# Altium project Mixed_Signal.PrjPcb
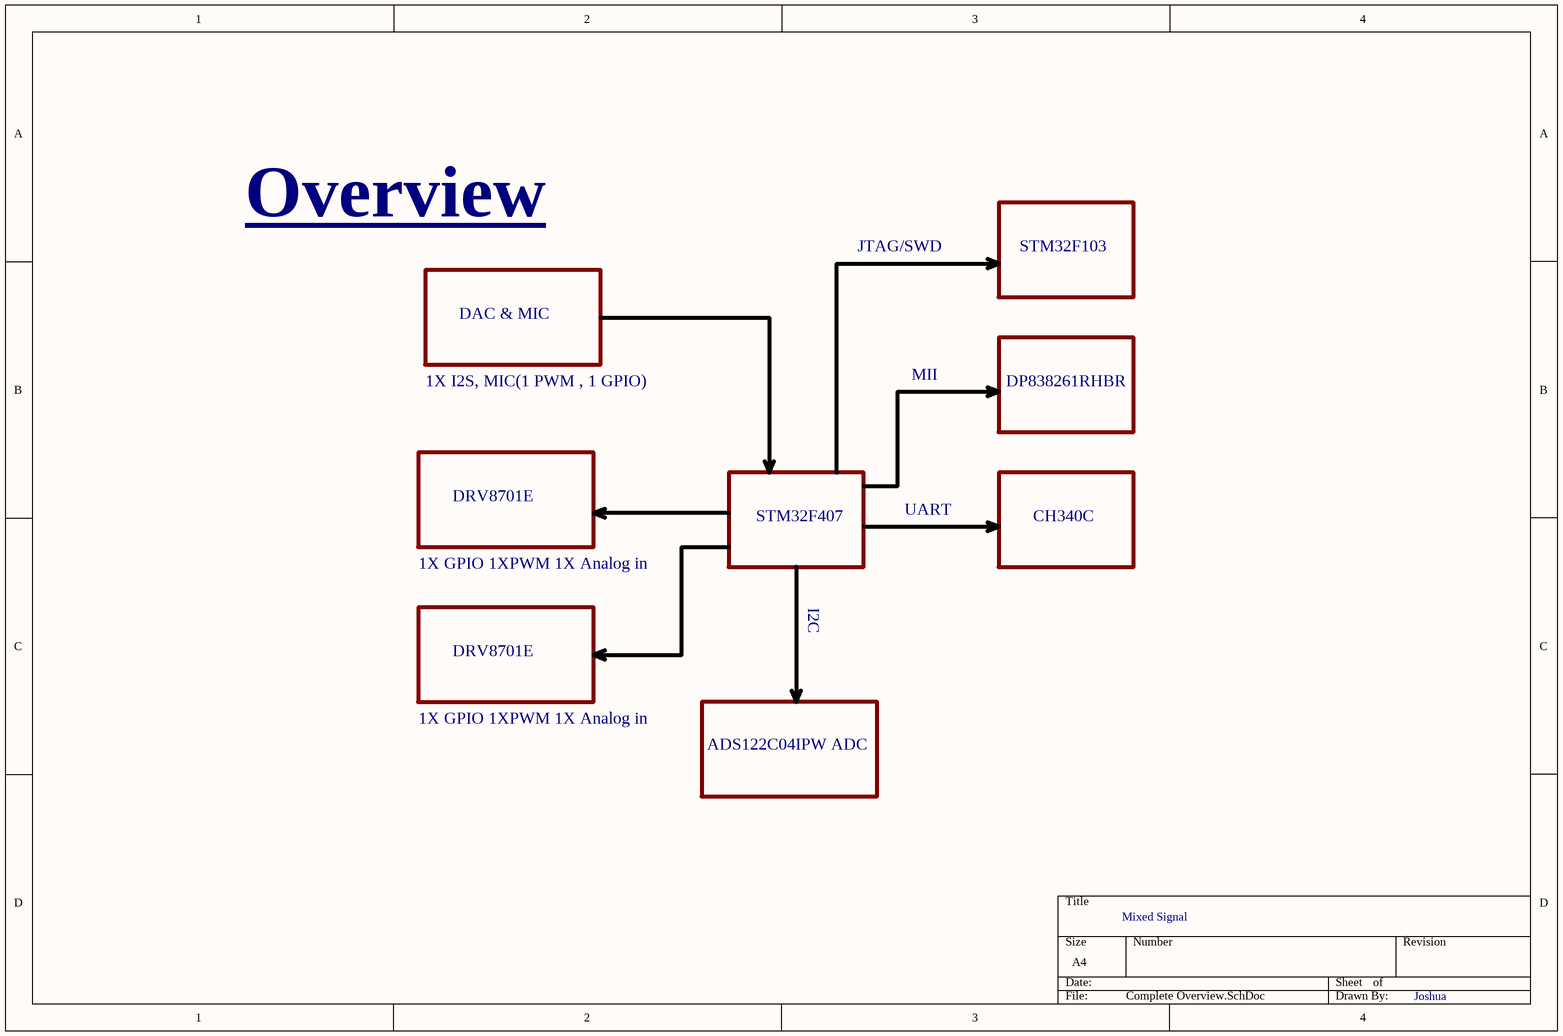
[diagram p0: Complete Overview.SchDoc]
12 sheets, 188 parts. Net scope: flat (ports and power ports of the same name join across sheets).
Board file: Mixed_Board.PcbDoc
Sheets:
  Complete Overview.SchDoc
  Ethernet Overview.SchDoc
  Power Block.SchDoc
  STM32Debuuger.SchDoc
  EthernetPHY.SchDoc
  MotorDriver.SchDoc
  MotorDriver2.SchDoc
  ADC.SchDoc
  DAC.SchDoc
  STM32F407.SchDoc
  Power.SchDoc
  USB-TTL.SchDoc

## Sheet Complete Overview.SchDoc
size A4; DocumentNumber: 1; SheetNumber: 1; SheetTotal: 12

### Notes on the sheet
- Overview
- JTAG/SWD
- STM32F103
- DAC & MIC
- MII
- 1X I2S, MIC(1 PWM , 1 GPIO)
- DP838261RHBR
- DRV8701E
- UART
- 1X GPIO 1XPWM 1X Analog in
- STM32F407
- CH340C
- I2C
- ADS122C04IPW ADC
- Mixed Signal
- Joshua

## Sheet Ethernet Overview.SchDoc
size A4; DocumentNumber: 2; SheetNumber: 2; SheetTotal: 12
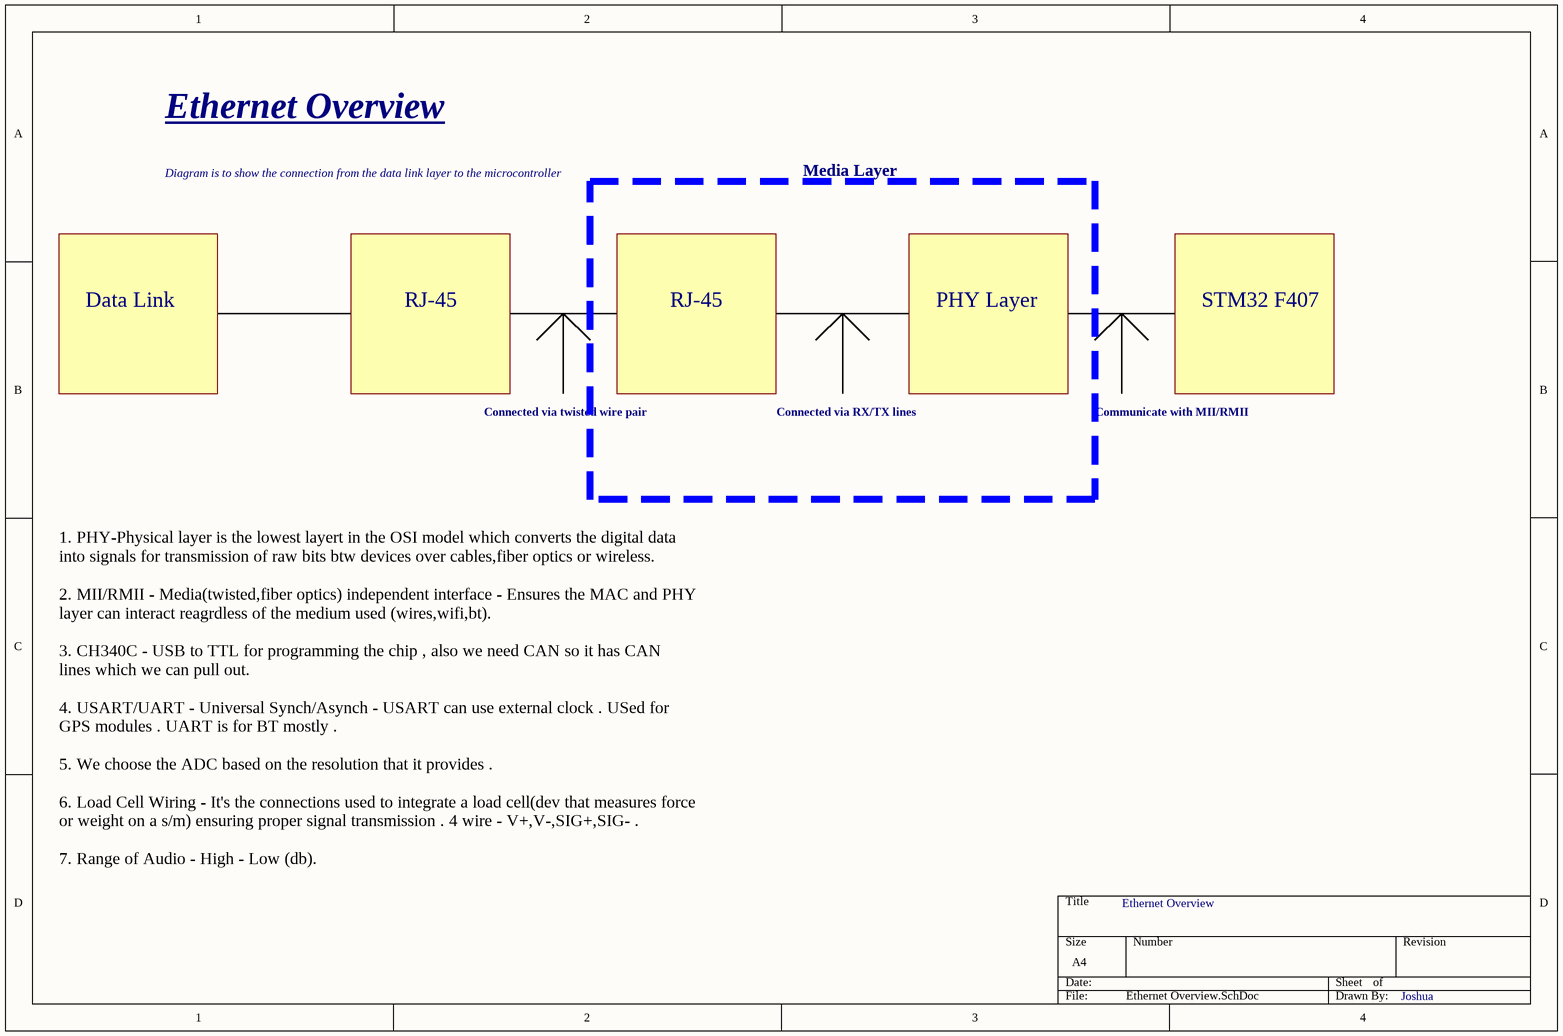
[diagram p1: Ethernet Overview.SchDoc]

### Notes on the sheet
- Ethernet Overview
- Diagram is to show the connection from the data link layer to the microcontroller
- Media Layer
- Data Link
- RJ-45
- PHY Layer
- STM32 F407
- Connected via twisted wire pair
- Connected via RX/TX lines
- Communicate with MII/RMII
- 1. PHY-Physical layer is the lowest layert in the OSI model which converts the digital data into signals for transmission of raw bits btw devices over cables,fiber optics or wireless.
  2. MII/RMII - Media(twisted,fiber optics) independent interface - Ensures the MAC and PHY layer can interact reagrdless of the medium used (wires,wifi,bt).
  3. CH340C - USB to TTL for programming the chip , also we need CAN so it has CAN lines which we can pull out.
  4. USART/UART - Universal Synch/Asynch - USART can use external clock . USed for GPS modules . UART is for BT mostly .
  5. We choose the ADC based on the resolution that it provides .
  6. Load Cell Wiring - It's the connections used to integrate a load cell(dev that measures force or weight on a s/m) ensuring proper signal transmission . 4 wire - V+,V-,SIG+,SIG- .
  7. Range of Audio - High - Low (db).
- Joshua

## Sheet Power Block.SchDoc
size A4; DocumentNumber: 3; SheetNumber: 3; SheetTotal: 12
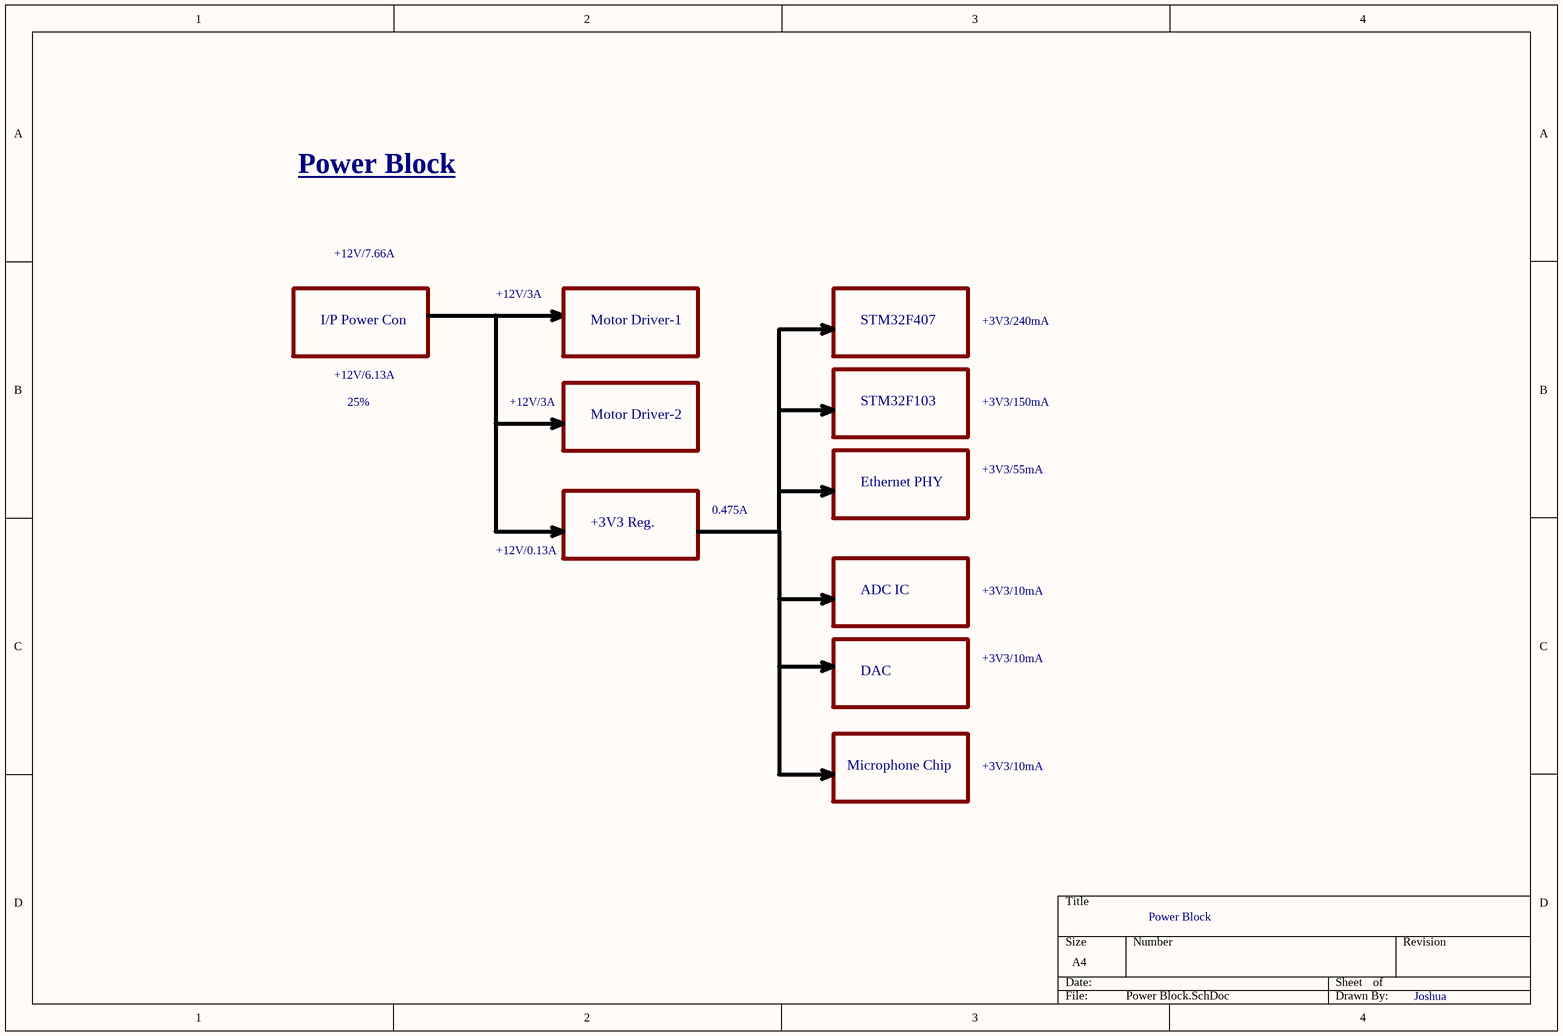
[diagram p2: Power Block.SchDoc]

### Notes on the sheet
- Power Block
- +12V/7.66A
- +12V/3A
- I/P Power Con
- +12V/6.13A
- Motor Driver-1
- STM32F407
- +3V3/240mA
- 25%
- Motor Driver-2
- STM32F103
- +3V3/150mA
- 0.475A
- Ethernet PHY
- +3V3/55mA
- +12V/0.13A
- +3V3 Reg.
- ADC IC
- +3V3/10mA
- DAC
- Microphone Chip
- Joshua

## Sheet STM32Debuuger.SchDoc
size A4; DocumentNumber: 4; SheetNumber: 4; SheetTotal: 12
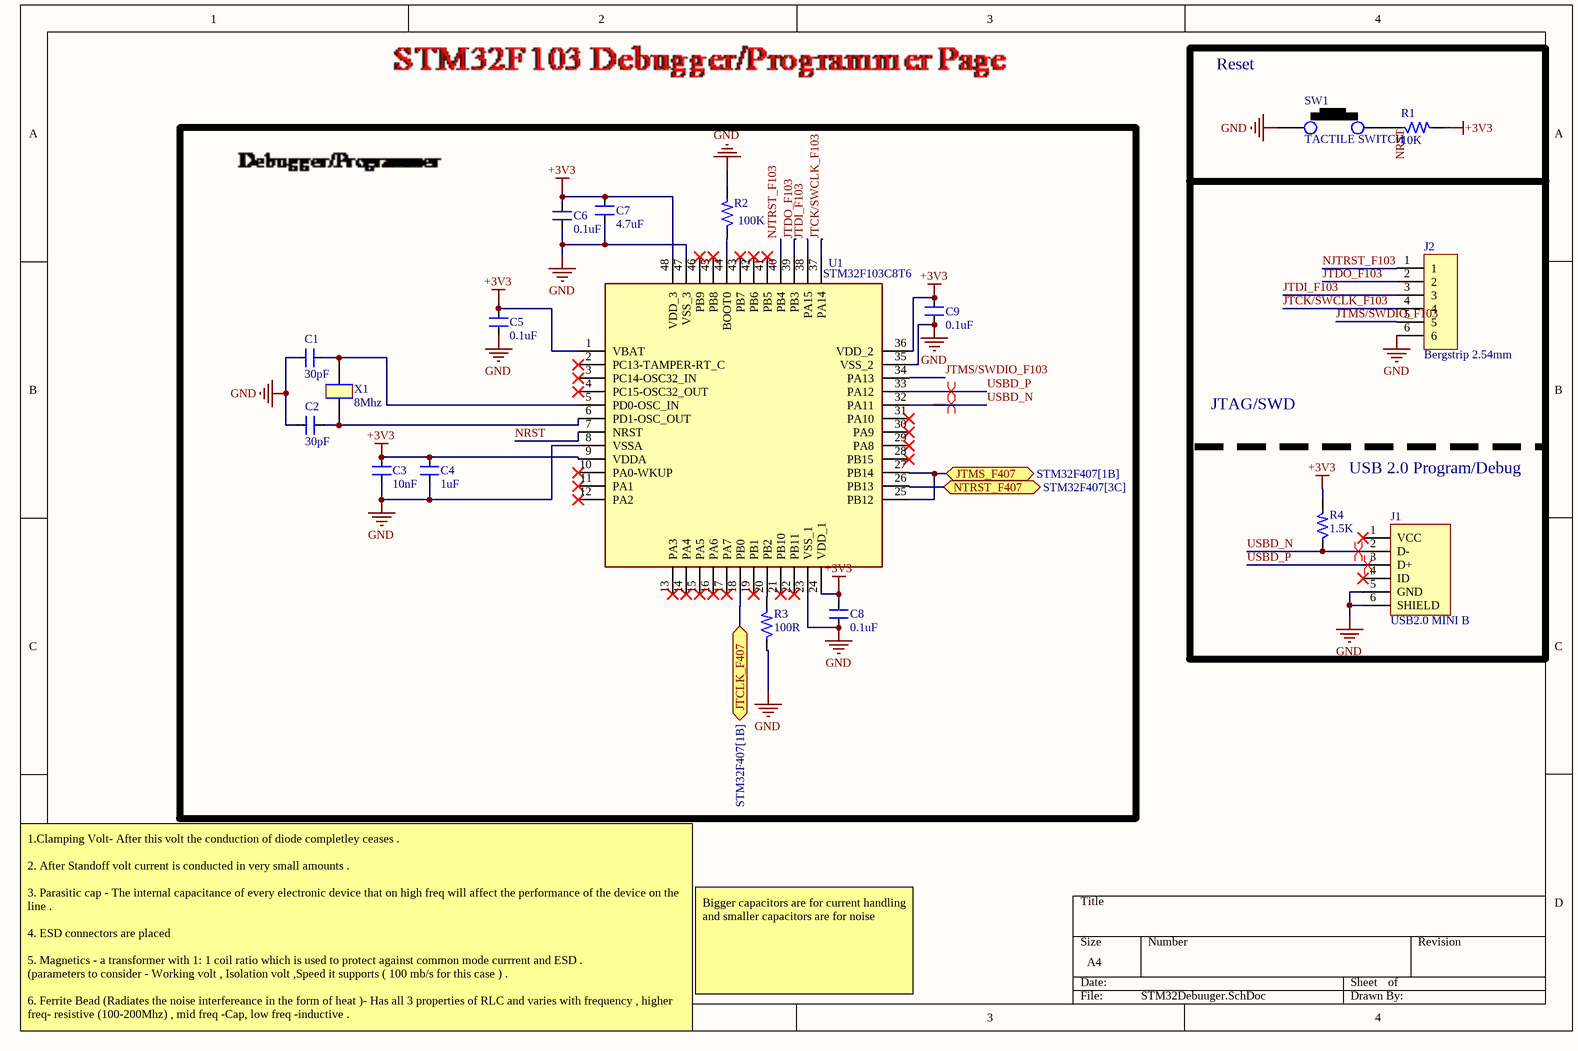
[diagram p3: STM32Debuuger.SchDoc]

### Parts
C1  30pF  [CAP_0805]
C2  30pF  [CAP_0805]
C3  10nF  [CAP_0805]
C4  1uF  [CAP_0805]
C5  0.1uF  [CAP_0805]
C6  0.1uF  [CAP_0805]
C7  4.7uF  [CAP_0805]
C8  0.1uF  [CAP_0805]
C9  0.1uF  [CAP_0805]
J1  USB2.0 MINI B  [CON_690-005-299-043]
J2  Bergstrip 2.54mm  [CON6_100_59D78_TH_ST]
R1  10K  [RES_0603]
R2  100K  [RES_0805]
R3  100R  [RES_0603]
R4  1.5K  [RES_0805]
SW1  TACTILE SWITCH  [SW_342_SMD]
U1  STM32F103C8T6  [LQFP-48_19.6_393_58X11_SMD]
X1  8Mhz  [XTAL_314_240X47_SMD]

### Ports
JTCLK_F407 (bidir, see STM32F407[1B]), JTMS_F407 (bidir, see STM32F407[1B]), NTRST_F407 (bidir, see STM32F407[3C])

### Nets
+3V3: C3.2 C4.2 C5.2 C6.2 C7.2 C8.2 C9.2 R1.2 R4.2 U1.1(VBAT) U1.9(VDDA) U1.24(VDD_1) U1.36(VDD_2) U1.48(VDD_3)
GND: C1.1 C2.1 C3.1 C4.1 C5.1 C6.1 C7.1 C8.1 C9.1 J1.5(GND) J1.6(SHIELD) J2.6 R2.2 R3.1 SW1.1 U1.8(VSSA) U1.23(VSS_1) U1.35(VSS_2) U1.47(VSS_3)
JTCK/SWCLK_F103: J2.4 U1.37(PA14)
JTDI_F103: J2.3 U1.38(PA15)
JTDO_F103: J2.2 U1.39(PB3)
JTMS/SWDIO_F103: J2.5 U1.34(PA13)
NJTRST_F103: J2.1 U1.40(PB4)
NRST: R1.1 SW1.2 U1.7(NRST)
NTRST_F407: U1.26(PB13) ; port NTRST_F407
USBD_N: J1.2(D-) R4.1 U1.32(PA11)
USBD_P: J1.3(D+) U1.33(PA12)
NetC1_2: C1.2 U1.5(PD0-OSC_IN) X1.2
NetC2_2: C2.2 U1.6(PD1-OSC_OUT) X1.1
NetR2_1: R2.1 U1.44(BOOT0)
NetR3_2: R3.2 U1.20(PB2)
NetU1_18: U1.18(PB0) ; port JTCLK_F407
NetU1_25: U1.25(PB12) U1.27(PB14) ; port JTMS_F407

Not connected (* = marked no-connect by the designer): J1 1(VCC)* 4(ID)*; U1 2(PC13-TAMPER-RT_C)* 3(PC14-OSC32_IN)* 4(PC15-OSC32_OUT)* 10(PA0-WKUP)* 11(PA1)* 12(PA2)* 13(PA3)* 14(PA4)* 15(PA5)* 16(PA6)* 17(PA7)* 19(PB1)* 21(PB10)* 22(PB11)* 28(PB15)* 29(PA8)* 30(PA9)* 31(PA10)* 41(PB5)* 42(PB6)* 43(PB7)* 45(PB8)* 46(PB9)*

### Layout directives
differential pair: (no net found under the mark), USBD_N, USBD_P

### Notes on the sheet
- Reset
- JTAG/SWD
- USB 2.0 Program/Debug
- Bigger capacitors are for current handling and smaller capacitors are for noise
- 1.Clamping Volt- After this volt the conduction of diode completley ceases .
  2. After Standoff volt current is conducted in very small amounts .
  3. Parasitic cap - The internal capacitance of every electronic device that on high freq will affect the performance of the device on the line .
  4. ESD connectors are placed
  5. Magnetics - a transformer with 1: 1 coil ratio which is used to protect against common mode currrent and ESD .
  (parameters to consider - Working volt , Isolation volt ,Speed it supports ( 100 mb/s for this case ) .
  6. Ferrite Bead (Radiates the noise interfereance in the form of heat )- Has all 3 properties of RLC and varies with frequency , higher freq- resistive (100-200Mhz) , mid freq -Cap, low freq -inductive .
  7.

### Library data of the parts
C1 C2 = CAP_30pF-50V-10%-0805: ±10% 50V Ceramic Capacitor C0G, NP0 0805 (2012 Metric); Manufacturer Part Number: C0805C300K5GAC7800; Manufacturer: KEMET; Alternate Part Number: NA; Case/Package: 0805; Supplier-1: Digikey; Supplier Part Number-1: 399-17443-1-ND - Cut Tape (CT)
C3 = CAP_10nF-50V-10%-0805: 10000pF ±10% 50V Ceramic Capacitor X7R 0805 (2012 Metric); Manufacturer: Samsung; Manufacturer Part Number: C0805C103K5RECAUTO; Alternate Part Number-1: GRM2195C1H103JA01D; Case/Package: 0805; Supplier-1: SIRICOM; Supplier Part Number-1: 0805B103K500CT
C4 = CAP_1uF-50V-5%-0805: 1µF ±5% 50V Ceramic Capacitor X7R 0805 (2012 Metric); Manufacturer: Samsung; Manufacturer Part Number: CC0805JKX7R9BB105; Alternate Part Number-1: 0805F105M500NT; Case/Package: 0805; Supplier-1: SIRICOM; Supplier Part Number-1: CL21B105KBFNNNE
C5 C6 C8 C9 = CAP_0.1uF-50V-10%-0805: 0.1µF ±10% 50V Ceramic Capacitor X7R 0805 (2012 Metric); Manufacturer: Samsung; Manufacturer Part Number: CL21B104KBCNNNC; Alternate Part Number-1: NA; Case/Package: 0805; Supplier-1: SIRICOM; Supplier Part Number-1: 0805B104K500CT
C7 = CAP_4.7uF-50V-10%-0805: 4.7µF ±10% 50V Ceramic Capacitor X5R 0805 (2012 Metric); Manufacturer: Yageo; Manufacturer Part Number: GRM21BR61H475KE51L; Alternate Part Number-1: NA; Case/Package: 0805; Supplier-1: SIRICOM; Supplier Part Number-1: CL21A475KBQNNNE
J1 = CON_USB2.0-MINIB-SMD: USB - mini B USB 2.0 Receptacle Connector 5 Position Surface Mount, Right Angle; Manufacturer: EDAC; Manufacturer Part Number: 690-005-299-043; Alternate Part Number-1: NA; Case/Package: USB-MINI-B; Supplier-1: LCSC; Supplier Part Number-1: C105424
J2 = CON-BS-SKT_6X1-100-ST-TH: 6 Pins, 1 Row 2.54mm Pitch, Straight bergstrip, Female; Manufacturer: Molex; Alternate Part Number-1: NA; Manufacturer Part Number: 22-10-2061; Case/Package: TH-CON; Supplier-1: SP ROAD; Supplier Part Number-1: NA
R1 = RES_10K-0.1W-1%-0603: 10 kOhms ±1% 0.1W, 1/10W Chip Resistor 0603 (1608 Metric) Automotive AEC-Q200 Thick Film; Manufacturer: Walsin; Manufacturer Part Number: WR06X1002FTL; Alternate Part Number-1: 0603WAJ0103T5E; Case/Package: 0603; Supplier-1: SIRICOM; Supplier Part Number-1: WR06X1002FTL
R2 = RES_100K-0.125W-1%-0805: 100 kOhms ±1% 0.125W, 1/8W Chip Resistor 0805 (2012 Metric) Automotive AEC-Q200 Thick Film; Manufacturer: Walsin; Manufacturer Part Number: WR08X1003FTL; Alternate Part Number-1: NA; Case/Package: 0805; Supplier-1: SIRICOM; Supplier Part Number-1: WR08X1003FTL
R3 = RES_100R-0.1W-1%-0603: 100 Ohms ±1% 0.1W, 1/10W Chip Resistor 0603 (1608 Metric) Thick Film; Manufacturer: Walsin; Manufacturer Part Number: WR06X1000FTL; Alternate Part Number-1: MR06X1000FTL; Case/Package: 0603; Supplier-1: SIRICOM; Supplier Part Number-1: WALSIN:WR06X1000FTL
R4 = RES_1.5K-0.125W-1%-0805: 1.5 kOhms ±1% 0.125W, 1/8W Chip Resistor 0805 (2012 Metric) Thick Film; Manufacturer: TE Connectivity Passive Product; Manufacturer Part Number: CRG0805F1K5; Alternate Part Number-1: NA; Case/Package: 0805; Supplier-1: SIRICOM; Supplier Part Number-1: NA
SW1 = SW1_RS-282G05A3-SMRT-SMD: Tactile Switch SPST-NO Top Actuated Surface Mount; Manufacturer: ITT C&K; Alternate Part Number-1: NA; Manufacturer Part Number: RS-282G05A3-SMRT; Case/Package: SMD; Supplier-1: SP ROAD; Supplier Part Number-1: RS-282G05A3-SMRT
U1 = IC_STM32F103C8T6: ARM® Cortex®-M3 STM32F1 Microcontroller IC 32-Bit 72MHz 64KB (64K x 8) FLASH 48-LQFP (7x7); Manufacturer: STMicroelectronics; Alternate Part Number-1: NA; Manufacturer Part Number: STM32F103C8T6; Case/Package: LQFP48; Supplier-1: LCSC; Supplier Part Number-1: STM32F103C8T6
X1 = XTAL_8MHZ-ECS-80-32-5PX-SMD: 8MHz ±30ppm Crystal 32pF 60 Ohms HC-49/US; Manufacturer: Fox Electronics; Manufacturer Part Number: ECS-80-32-5PX-TR; Alternate Part Number-1: NA; Case/Package: SMD/SMT; Supplier-1: SP ROAD; Supplier Part Number-1: ECS-80-32-5PX-TR

## Sheet EthernetPHY.SchDoc
size A4; DocumentNumber: 5; SheetNumber: 5; SheetTotal: 12
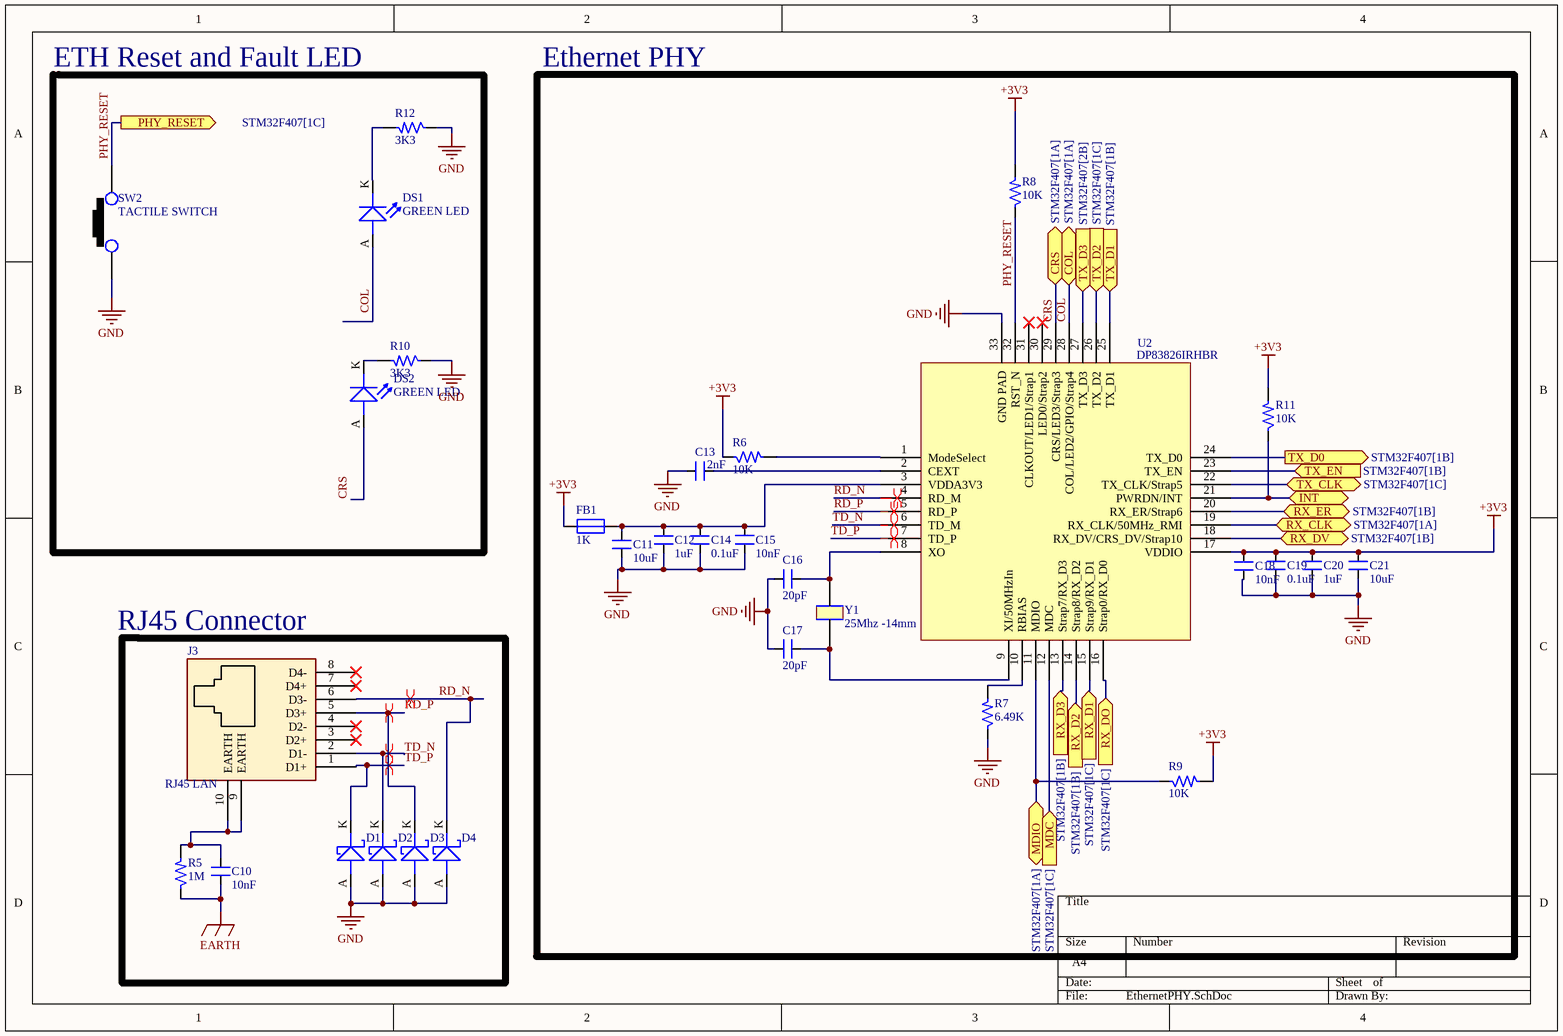
[diagram p4: EthernetPHY.SchDoc]

### Parts
C10  10nF  [CAP_P196_102X287_H332_RAD_TH]
C11  10uF  [CAP_1206]
C12  1uF  [CAP_0805]
C13  2nF  [CAP_0805]
C14  0.1uF  [CAP_0805]
C15  10nF  [CAP_0805]
C16  20pF  [CAP_0805]
C17  20pF  [CAP_0805]
C18  10nF  [CAP_0805]
C19  0.1uF  [CAP_0805]
C20  1uF  [CAP_0805]
C21  10uF  [CAP_1206]
D1  ESD3V3D9-TP  [DIO_SOD-923]  (value not drawn)
D2  ESD3V3D9-TP  [DIO_SOD-923]  (value not drawn)
D3  ESD3V3D9-TP  [DIO_SOD-923]  (value not drawn)
D4  ESD3V3D9-TP  [DIO_SOD-923]  (value not drawn)
DS1  GREEN LED  [LED_0805]
DS2  GREEN LED  [LED_0805]
FB1  1K  [IND_0805]
J3  RJ45 LAN  [CON10_P106_RJ45_TH_ST]
R5  1M  [RES_0805]
R6  10K  [RES_0603]
R7  6.49K  [RES_0805]
R8  10K  [RES_0603]
R9  10K  [RES_0603]
R10  3K3  [RES_0603]
R11  10K  [RES_0805]
R12  3K3  [RES_0603]
SW2  TACTILE SWITCH  [SW_342_SMD]
U2  DP83826IRHBR  [VQFN32_19_218_23X9_SMD]
Y1  25Mhz -14mm  [XTAL_314_240X47_SMD]

### Blocks framed on the sheet
ETH Reset and Fault LED: DS1 DS2 R10 R12 SW2
Ethernet PHY: C11-C21 FB1 R6-R9 R11 U2 Y1

### Ports
COL (bidir, see STM32F407[1A]), CRS (bidir, see STM32F407[1A]), INT (bidir), MDC (in, see STM32F407[1C]), MDIO (bidir, see STM32F407[1A]), PHY_RESET (out, see STM32F407[1C]), RX_CLK (bidir, see STM32F407[1A]), RX_D1 (in, see STM32F407[1C]), RX_D2 (in, see STM32F407[1B]), RX_D3 (in, see STM32F407[1B]), RX_DO (in, see STM32F407[1C]), RX_DV (bidir, see STM32F407[1B]), RX_ER (bidir, see STM32F407[1B]), TX_CLK (bidir, see STM32F407[1C]), TX_D0 (out, see STM32F407[1B]), TX_D1 (in, see STM32F407[1B]), TX_D2 (in, see STM32F407[1C]), TX_D3 (in, see STM32F407[2B]), TX_EN (in, see STM32F407[1B])

### Nets
+3V3: C18.2 C19.2 C20.2 C21.2 FB1.1 R6.1 R8.2 R9.2 R11.2 U2.17(VDDIO)
EARTH: C10.1 R5.1
GND: C11.1 C12.1 C13.1 C14.1 C15.1 C16.1 C17.1 C18.1 C19.1 C20.1 C21.1 D1.A D2.A D3.A D4.A R7.1 R10.1 R12.1 SW2.1 U2.33(GND_PAD)
COL: DS1.A(ANODE) U2.28(COL/LED2/GPIO/Strap4) ; port COL
CRS: DS2.A(ANODE) U2.29(CRS/LED3/Strap3) ; port CRS
PHY_RESET: R8.1 SW2.2 U2.32(RST_N) ; port PHY_RESET
RD_N: D4.K J3.6(D3-) U2.4(RD_M)
RD_P: D3.K J3.5(D3+) U2.5(RD_P)
TD_N: D2.K J3.2(D1-) U2.6(TD_M)
TD_P: D1.K J3.1(D1+) U2.7(TD_P)
NetC10_2: C10.2 J3.9(EARTH) J3.10(EARTH) R5.2
NetC11_2: C11.2 C12.2 C14.2 C15.2 FB1.2 U2.3(VDDA3V3)
NetC13_2: C13.2 U2.2(CEXT)
NetC16_2: C16.2 U2.8(XO) Y1.2
NetC17_2: C17.2 U2.9(XI/50MHzIn) Y1.1
NetDS1_K: DS1.K(CATHODE) R12.2
NetDS2_K: DS2.K(CATHODE) R10.2
NetR6_2: R6.2 U2.1(ModeSelect)
NetR7_2: R7.2 U2.10(RBIAS)
NetR9_1: R9.1 U2.11(MDIO) ; port MDIO
NetR11_1: R11.1 U2.21(PWRDN/INT) ; port INT
NetU2_12: U2.12(MDC) ; port MDC
NetU2_13: U2.13(Strap7/RX_D3) ; port RX_D3
NetU2_14: U2.14(Strap8/RX_D2) ; port RX_D2
NetU2_15: U2.15(Strap9/RX_D1) ; port RX_D1
NetU2_16: U2.16(Strap0/RX_D0) ; port RX_DO
NetU2_18: U2.18(RX_DV/CRS_DV/Strap10) ; port RX_DV
NetU2_19: U2.19(RX_CLK/50MHz_RMI) ; port RX_CLK
NetU2_20: U2.20(RX_ER/Strap6) ; port RX_ER
NetU2_22: U2.22(TX_CLK/Strap5) ; port TX_CLK
NetU2_23: U2.23(TX_EN) ; port TX_EN
NetU2_24: U2.24(TX_D0) ; port TX_D0
NetU2_25: U2.25(TX_D1) ; port TX_D1
NetU2_26: U2.26(TX_D2) ; port TX_D2
NetU2_27: U2.27(TX_D3) ; port TX_D3

Not connected (* = marked no-connect by the designer): J3 3(D2+)* 4(D2-)* 7(D4+)* 8(D4-)*; U2 30(LED0/Strap2)* 31(CLKOUT/LED1/Strap1)*

### Layout directives
differential pair: RD_N, RD_P, TD_N, TD_P

### Notes on the sheet
- (near J3) RJ45 Connector

### Library data of the parts
C10 = CAP_10nF-1KV-10%-RAD-TH: 10000pF ±10% 1000V (1kV) Ceramic Capacitor X7R Radial; Manufacturer: Yageo; Manufacturer Part Number: RDER73A103K2K1H03B; Alternate Part Number-1: NA; Case/Package: TH; Supplier-1: SP ROAD; Supplier Part Number-1: RDER73A103K2K1H03B
C11 C21 = CAP_10uF-50V-10%-1206: 10µF ±10% 50V Ceramic Capacitor X7R 1206 (3216 Metric); Manufacturer: KEMET; Manufacturer Part Number: CL31B106KBHNNNE; Alternate Part Number-1: GRT31CR61H106ME01L; Case/Package: 1206; Supplier-1: SIRICOM; Supplier Part Number-1: CC1206KKX5R9BB106
C12 C20 = CAP_1uF-50V-5%-0805: as C4 on sheet STM32Debuuger; Case/Package: 0805; Supplier-1: SIRICOM; Supplier Part Number-1: CL21B105KBFNNNE
C13 = CAP_2nF-50V-10%-0805: 2000pF ±10% 50V Ceramic Capacitor X7R 0805 (2012 Metric); Manufacturer: Samsung Electro-Mechanics; Manufacturer Part Number: CL21B202KBANNNC; Alternate Part Number-1: NA; Case/Package: 0805; Supplier-1: Digikey; Supplier Part Number-1: 1276-2471-1-ND - Cut Tape (CT)
C14 C19 = CAP_0.1uF-50V-10%-0805: as C5 on sheet STM32Debuuger; Case/Package: 0805; Supplier-1: SIRICOM; Supplier Part Number-1: 0805B104K500CT
C15 C18 = CAP_10nF-50V-10%-0805: as C3 on sheet STM32Debuuger; Case/Package: 0805; Supplier-1: SIRICOM; Supplier Part Number-1: 0805B103K500CT
C16 C17 = CAP_20pF-50V-10%-0805: ±10% 50V Ceramic Capacitor C0G, NP0 0805 (2012 Metric); Manufacturer: AVX Corporation; Manufacturer Part Number: 08055A200KAT2A; Alternate Part Number-1: NA; Case/Package: 0805; Supplier-1: Digikey; Supplier Part Number-1: 478-11887-1-ND - Cut Tape (CT)
D1-D4 = DIO-T_3.3V-8.8V-SOD923: 8.8V Clamp 5A (8/20µs) Ipp Tvs Diode Surface Mount SOD-923; Manufacturer: Micro Commercial Co; Alternate Part Number-1: NA; Manufacturer Part Number: ESD3V3D9-TP; Case/Package: SOD923; Supplier-1: Digikey; Supplier Part Number-1: ESD3V3D9-TPMSCT-ND - Cut Tape (CT)
DS1 DS2 = LED_GREEN-2.2-20mA-0805: Green 569nm LED Indication - Discrete 2.1V 0805 (2012 Metric); Manufacturer: Vishay Lite-On; Manufacturer Part Number: LTST-C171GKT; Alternate Part Number-1: NA; Case/Package: 0805; Supplier-1: SP ROAD; Supplier Part Number-1: LTST-C171GKT
FB1 = FB_1K-100MHZ-1.6A-0805: 1 kOhms @ 100MHz 1 Power Line Ferrite Bead 0805 (2012 Metric) 1.6A; Manufacturer: Laird; Manufacturer Part Number: BLM21SP102SH1D; Alternate Part Number-1: NA; Case/Package: 0805; Supplier-1: SIRICOM; Supplier Part Number-1: ACMS201209A102
J3 = CON-SKT-RJ_8C8P-RA-TH: 8 Pins, 2 Row 2.54mm Pitch, right angle Connector, male; Manufacturer: Assmann; Manufacturer Part Number: A-2004-2-4-LPS-N-R; Alternate Part Number-1: NA; Case/Package: TH-CON; Supplier-1: SP ROAD; Supplier Part Number-1: A-2004-2-4-LPS-N-R
R5 = RES_1M-0.125W-1%-0805: 1 MOhms ±1% 0.125W, 1/8W Chip Resistor 0805 (2012 Metric) Automotive AEC-Q200 Thick Film; Manufacturer: Walsin; Manufacturer Part Number: WR08X1004FTL; Alternate Part Number-1: 0805W8F1004T5E; Case/Package: 0805; Supplier-1: SIRICOM; Supplier Part Number-1: WR08X1004FTL
R6 R8 R9 = RES_10K-0.1W-1%-0603: as R1 on sheet STM32Debuuger; Case/Package: 0603; Supplier-1: SIRICOM; Supplier Part Number-1: WR06X1002FTL
R7 = RES_6.49K-0.125W-1%-0805: 6.49 kOhms ±1% 0.125W, 1/8W Chip Resistor 0805 (2012 Metric) Moisture Resistant Thick Film; Manufacturer: Stackpole Electronics; Manufacturer Part Number: RC0805FR-076K49L; Alternate Part Number-1: NA; Case/Package: 0805; Supplier-1: SIRICOM; Supplier Part Number-1: WRO8X6491FTL
R10 R12 = RES_3.3K-0.1W-1%-0603: 3.3 kOhms ±1% 0.1W, 1/10W Chip Resistor 0603 (1608 Metric) Automotive AEC-Q200 Thick Film; Manufacturer: Wilson; Manufacturer Part Number: WR06X3301FTL; Alternate Part Number-1: 0603WAF3301T5E; Case/Package: 0603; Supplier-1: SIRICOM; Supplier Part Number-1: WR06X3301FTL
R11 = RES_10K-0.125W-1%-0805: 10 kOhms ±1% 0.125W, 1/8W Chip Resistor 0805 (2012 Metric) Automotive AEC-Q200 Thick Film; Manufacturer: CTS; Manufacturer Part Number: WR08X1002FTL; Case/Package: 0805; Supplier-1: SIRICOM; Supplier Part Number-1: WR08X1002FTL; Alternate Part Number-1: WR08X1002FTL
SW2 = SW1_RS-282G05A3-SMRT-SMD: as SW1 on sheet STM32Debuuger; Manufacturer Part Number: RS-282G05A3-SMRT; Case/Package: SMD; Supplier-1: SP ROAD; Supplier Part Number-1: RS-282G05A3-SMRT
U2 = IC_DP83826IRHBR: Ethernet ICs Low latency 10/100-Mbps PHY, MII interface and enhanced mode with an industrial temperature range 32-VQFN -40 to 85; Manufacturer: Texas Instruments; Alternate Part Number-1: NA; Manufacturer Part Number: DP83826IRHBR; Case/Package: 32-VQFN; Supplier-1: Mouser; Supplier Part Number-1: 595-DP83826IRHBR
Y1 = XTAL_25Mhz-FOXSDLF/250F-20: 25MHz ±30ppm Crystal 20pF 30 Ohms HC-49/US; Manufacturer: Abracon; Alternate Part Number-1: NA; Manufacturer Part Number: FOXSDLF/250F-20; Case/Package: SMD; Supplier-1: MOUSER; Supplier Part Number-1: FOXSDLF/250F-20

## Sheet MotorDriver.SchDoc
size A4; DocumentNumber: 6; SheetNumber: 6; SheetTotal: 12
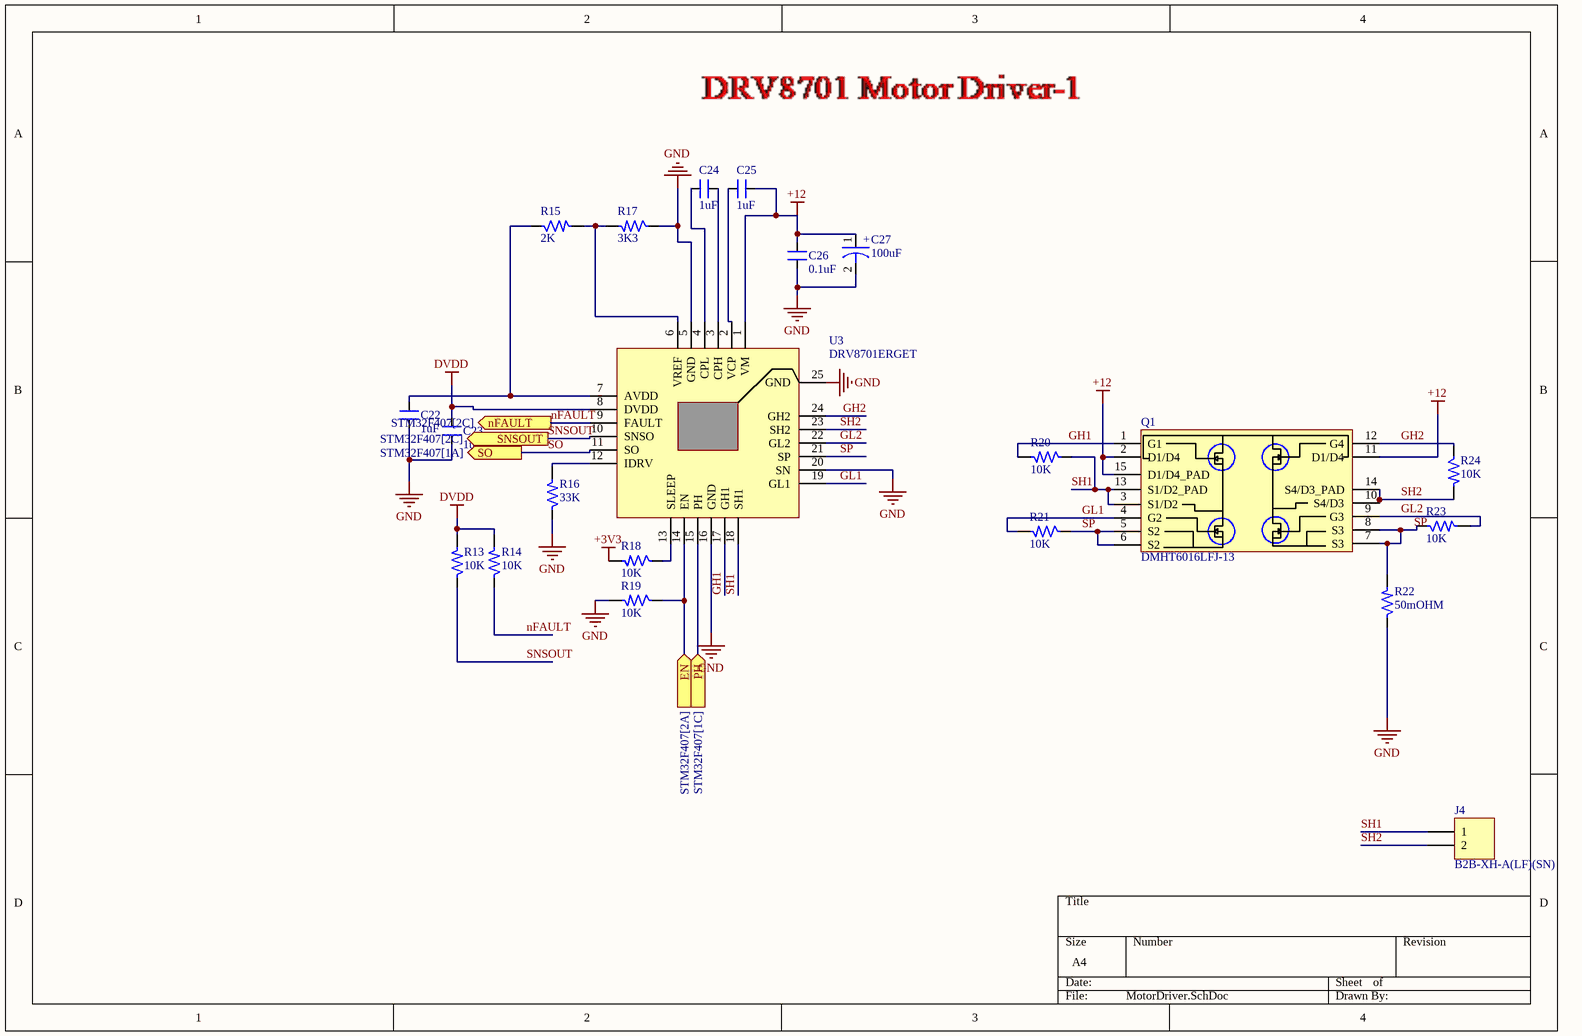
[diagram p5: MotorDriver.SchDoc]

### Parts
C22  1uF  [CAP_0805]
C23  1uF  [CAP_0805]
C24  1uF  [CAP_0805]
C25  1uF  [CAP_0805]
C26  0.1uF  [CAP_0805]
C27  100uF  [ACAP_P236_D305_H303_RAD]
J4  B2B-XH-A(LF)(SN)  [CON2_100_B2B-XH-A_TH_ST]
Q1  DMHT6016LFJ-13  [DFN5045-12_33_212_27X15_SMD_1]
R13  10K  [RES_0603]
R14  10K  [RES_0603]
R15  2K  [RES_0805]
R16  33K  [RES_0805]
R17  3K3  [RES_0603]
R18  10K  [RES_0603]
R19  10K  [RES_0603]
R20  10K  [RES_0603]
R21  10K  [RES_0603]
R22  50mOHM  [RES_2512]
R23  10K  [RES_0603]
R24  10K  [RES_0603]
U3  DRV8701ERGET  [VFQFN24_19.6_196_12X32_SMD_1]

### Ports
EN (in, see STM32F407[2A]), nFAULT (out, see STM32F407[2C]), PH (in, see STM32F407[1C]), SNSOUT (out, see STM32F407[2C]), SO (out, see STM32F407[1A])

### Nets
+3V3: R18.2
+12: C25.2 C26.2 C27.1 Q1.2(D1/D4) Q1.11(D1/D4) Q1.15(D1/D4_PAD) U3.1(VM)
DVDD: C23.2 R13.2 R14.2 U3.8(DVDD)
GND: C22.1 C23.1 C26.1 C27.2 R16.1 R17.1 R19.2 R22.1 U3.5(GND) U3.16(GND) U3.20(SN) U3.25(GND)
GH1: Q1.1(G1) R20.2 U3.17(GH1)
GH2: Q1.12(G4) R24.1 U3.24(GH2)
GL1: Q1.4(G2) R21.2 U3.19(GL1)
GL2: Q1.9(G3) R23.2 U3.22(GL2)
nFAULT: R14.1 U3.9(FAULT) ; port nFAULT
SH1: J4.1 Q1.3(S1/D2) Q1.13(S1/D2_PAD) R20.1 U3.18(SH1)
SH2: J4.2 Q1.10(S4/D3) Q1.14(S4/D3_PAD) R24.2 U3.23(SH2)
SNSOUT: R13.1 U3.10(SNSO) ; port SNSOUT
SO: U3.11(SO) ; port SO
SP: Q1.5(S2) Q1.6(S2) Q1.7(S3) Q1.8(S3) R21.1 R22.2 R23.1 U3.21(SP)
NetC22_2: C22.2 R15.1 U3.7(AVDD)
NetC24_1: C24.1 U3.4(CPL)
NetC24_2: C24.2 U3.3(CPH)
NetC25_1: C25.1 U3.2(VCP)
NetR15_2: R15.2 R17.2 U3.6(VREF)
NetR16_2: R16.2 U3.12(IDRV)
NetR18_1: R18.1 U3.13(SLEEP)
NetR19_1: R19.1 U3.14(EN) ; port EN
NetU3_15: U3.15(PH) ; port PH

### Notes on the sheet
- (in symbol CAP-P_100uF-25V-20%-RAD) +

### Library data of the parts
C22-C25 = CAP_1uF-50V-5%-0805: as C4 on sheet STM32Debuuger; Case/Package: 0805; Supplier-1: SIRICOM; Supplier Part Number-1: CL21B105KBFNNNE
C26 = CAP_0.1uF-50V-10%-0805: as C5 on sheet STM32Debuuger; Case/Package: 0805; Supplier-1: SIRICOM; Supplier Part Number-1: 0805B104K500CT
C27 = CAP-P_100uF-25V-20%-RAD: 100µF 25V Aluminum Electrolytic Capacitors Radial, Can - SMD 1000 Hrs @ 105°C; Manufacturer: Nichicon; Manufacturer Part Number: UWT1E101MCL1GS; Alternate Part Number-1: NA; Case/Package: Radial-SMD; Supplier-1: SP ROAD; Supplier Part Number-1: UWT1E101MCL1GS
J4 = CON-PLG_2X1-100-ST-TH: 2 Pins, 1 Row 2.54mm Pitch, Straight Connector, male; Manufacturer: JST; Mating Part Number: XHP-2; Crimp Part Number: ASXHSXH22K51; Alternate Part Number-1: NA; Manufacturer Part Number: B2B-XH-A(LF)(SN); Case/Package: TH-CON; Supplier-1: SP ROAD; Supplier Part Number-1: B2B-XH-A(LF)(SN)
Q1 = MOSFET-N_60V-14.8A-V-DFN5045-12: Mosfet Array 4 N-Channel 14.8A (Ta) Surface Mount V-DFN5045-12; Manufacturer: ON Semiconductor; Alternate Part Number-1: DMHT3006LFJ-13; Manufacturer Part Number: DMHT6016LFJ-13; Case/Package: DFN5045-12; Supplier-1: LCSC; Supplier Part Number-1: C460986
R13 R14 R18-R21 R23 R24 = RES_10K-0.1W-1%-0603: as R1 on sheet STM32Debuuger; Case/Package: 0603; Supplier-1: SIRICOM; Supplier Part Number-1: WR06X1002FTL
R15 = RES_2K-0.125W-1%-0805: 2 kOhms ±1% 0.125W, 1/8W Chip Resistor 0805 (2012 Metric) Moisture Resistant Thick Film; Manufacturer: TE Connectivity; Manufacturer Part Number: RC0805FR-072KL; Alternate Part Number-1: NA; Case/Package: 0805; Supplier-1: SIRICOM; Supplier Part Number-1: WR08X2001FTL
R16 = RES_33K-0.125W-1%-0805: Thick Film Resistors - SMD 33KOhms 1/8W 150V33 kOhms ±1% 0.125W, 1/8W Chip Resistor 0805 (2012 Metric) Thick Film; Manufacturer: Vishay BCcomponents; Manufacturer Part Number: CRG0805F33K; Alternate Part Number-1: NA; Case/Package: 0805; Supplier-1: SIRICOM; Supplier Part Number-1: WR08X3302FTL
R17 = RES_3.3K-0.1W-1%-0603: as R10 on sheet EthernetPHY; Case/Package: 0603; Supplier-1: SIRICOM; Supplier Part Number-1: WR06X3301FTL
R22 = RES_50mOhm-2W-1%-2512: 50 mOhms ±1% 2W Chip Resistor 2512 (6432 Metric) Automotive AEC-Q200, Current Sense, Moisture Resistant Metal Element; Manufacturer: Yageo; Manufacturer Part Number: PA2512FKF7W0R05E; Alternate Part Number-1: PMR100HZPFU5L00; Case/Package: 2512; Supplier-1: SIRICOM; Supplier Part Number-1: LR2512-22R060F1
U3 = IC_DRV8701ERGET: Motor Driver Power MOSFET Parallel 24-VQFN (4x4); Manufacturer: Texas Instruments; Alternate Part Number-1: NA; Manufacturer Part Number: DRV8701ERGET; Case/Package: VFQFN24; Supplier-1: ARROW; Supplier Part Number-1: DRV8701ERGET

## Sheet MotorDriver2.SchDoc
size A4; DocumentNumber: 7; SheetNumber: 7; SheetTotal: 12
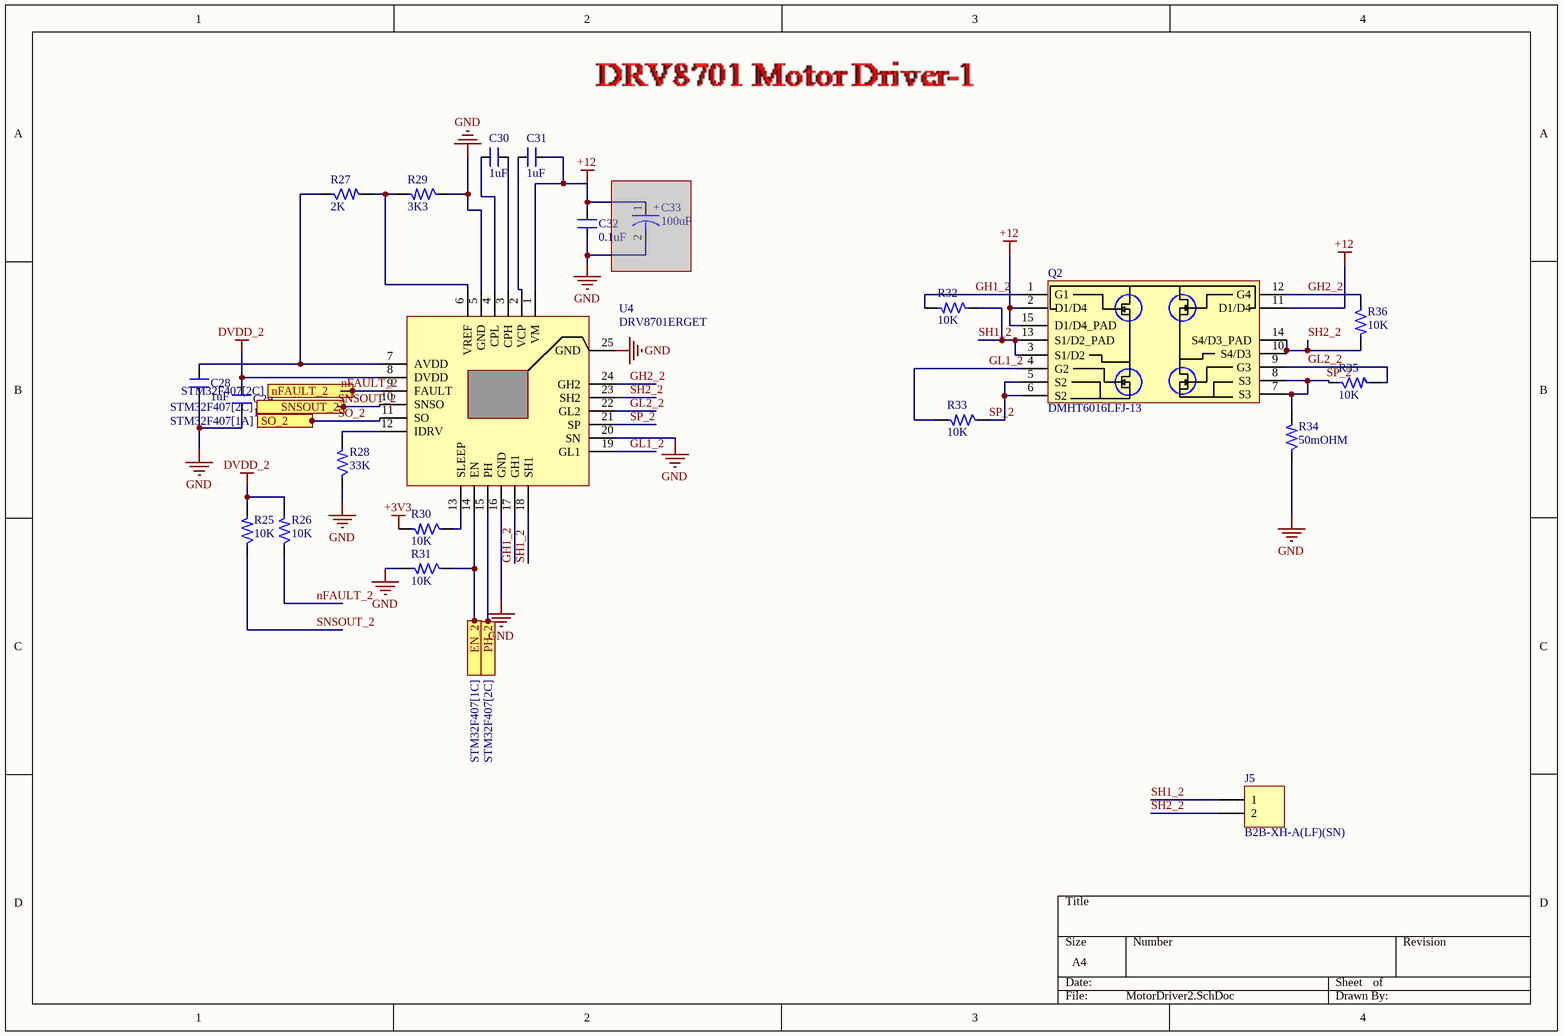
[diagram p6: MotorDriver2.SchDoc]

### Parts
C28  1uF  [CAP_0805]
C29  1uF  [CAP_0805]
C30  1uF  [CAP_0805]
C31  1uF  [CAP_0805]
C32  0.1uF  [CAP_0805]
C33  100uF  [ACAP_P236_D305_H303_RAD]  (masked out: inside a compile mask, not in the netlist)
J5  B2B-XH-A(LF)(SN)  [CON2_100_B2B-XH-A_TH_ST]
Q2  DMHT6016LFJ-13  [DFN5045-12_33_212_27X15_SMD_1]
R25  10K  [RES_0603]
R26  10K  [RES_0603]
R27  2K  [RES_0805]
R28  33K  [RES_0805]
R29  3K3  [RES_0603]
R30  10K  [RES_0603]
R31  10K  [RES_0603]
R32  10K  [RES_0603]
R33  10K  [RES_0603]
R34  50mOHM  [RES_2512]
R35  10K  [RES_0603]
R36  10K  [RES_0603]
U4  DRV8701ERGET  [VFQFN24_19.6_196_12X32_SMD_1]

### Ports
EN_2 (out, see STM32F407[1C]), nFAULT_2 (out, see STM32F407[2C]), PH_2 (in, see STM32F407[2C]), SNSOUT_2 (out, see STM32F407[2C]), SO_2 (out, see STM32F407[1A])

### Nets
+3V3: R30.2
+12: C31.2 C32.2 Q2.2(D1/D4) Q2.11(D1/D4) Q2.15(D1/D4_PAD) U4.1(VM)
DVDD_2: C29.2 R25.2 R26.2 U4.8(DVDD)
GND: C28.1 C29.1 C32.1 R28.1 R29.1 R31.2 R34.1 U4.5(GND) U4.16(GND) U4.20(SN) U4.25(GND)
GH1_2: Q2.1(G1) R32.2 U4.17(GH1)
GH2_2: Q2.12(G4) R36.1 U4.24(GH2)
GL1_2: Q2.4(G2) R33.2 U4.19(GL1)
GL2_2: Q2.9(G3) R35.2 U4.22(GL2)
nFAULT_2: R26.1 U4.9(FAULT) ; port nFAULT_2
SH1_2: J5.1 Q2.3(S1/D2) Q2.13(S1/D2_PAD) R32.1 U4.18(SH1)
SH2_2: J5.2 Q2.10(S4/D3) Q2.14(S4/D3_PAD) R36.2 U4.23(SH2)
SNSOUT_2: R25.1 U4.10(SNSO) ; port SNSOUT_2
SO_2: U4.11(SO) ; port SO_2
SP_2: Q2.5(S2) Q2.6(S2) Q2.7(S3) Q2.8(S3) R33.1 R34.2 R35.1 U4.21(SP)
NetC28_2: C28.2 R27.1 U4.7(AVDD)
NetC30_1: C30.1 U4.4(CPL)
NetC30_2: C30.2 U4.3(CPH)
NetC31_1: C31.1 U4.2(VCP)
NetR27_2: R27.2 R29.2 U4.6(VREF)
NetR28_2: R28.2 U4.12(IDRV)
NetR30_1: R30.1 U4.13(SLEEP)
NetR31_1: R31.1 U4.14(EN) ; port EN_2
NetU4_15: U4.15(PH) ; port PH_2

### Notes on the sheet
- (in symbol CAP-P_100uF-25V-20%-RAD) +

### Library data of the parts
C28-C31 = CAP_1uF-50V-5%-0805: as C4 on sheet STM32Debuuger; Case/Package: 0805; Supplier-1: SIRICOM; Supplier Part Number-1: CL21B105KBFNNNE
C32 = CAP_0.1uF-50V-10%-0805: as C5 on sheet STM32Debuuger; Case/Package: 0805; Supplier-1: SIRICOM; Supplier Part Number-1: 0805B104K500CT
C33 = CAP-P_100uF-25V-20%-RAD: as C27 on sheet MotorDriver; Case/Package: Radial-SMD; Supplier-1: SP ROAD; Supplier Part Number-1: UWT1E101MCL1GS
J5 = CON-PLG_2X1-100-ST-TH: as J4 on sheet MotorDriver; Manufacturer Part Number: B2B-XH-A(LF)(SN); Case/Package: TH-CON; Supplier-1: SP ROAD; Supplier Part Number-1: B2B-XH-A(LF)(SN)
Q2 = MOSFET-N_60V-14.8A-V-DFN5045-12: as Q1 on sheet MotorDriver; Manufacturer Part Number: DMHT6016LFJ-13; Case/Package: DFN5045-12; Supplier-1: LCSC; Supplier Part Number-1: C460986
R25 R26 R30-R33 R35 R36 = RES_10K-0.1W-1%-0603: as R1 on sheet STM32Debuuger; Case/Package: 0603; Supplier-1: SIRICOM; Supplier Part Number-1: WR06X1002FTL
R27 = RES_2K-0.125W-1%-0805: as R15 on sheet MotorDriver; Case/Package: 0805; Supplier-1: SIRICOM; Supplier Part Number-1: WR08X2001FTL
R28 = RES_33K-0.125W-1%-0805: as R16 on sheet MotorDriver; Case/Package: 0805; Supplier-1: SIRICOM; Supplier Part Number-1: WR08X3302FTL
R29 = RES_3.3K-0.1W-1%-0603: as R10 on sheet EthernetPHY; Case/Package: 0603; Supplier-1: SIRICOM; Supplier Part Number-1: WR06X3301FTL
R34 = RES_50mOhm-2W-1%-2512: as R22 on sheet MotorDriver; Case/Package: 2512; Supplier-1: SIRICOM; Supplier Part Number-1: LR2512-22R060F1
U4 = IC_DRV8701ERGET: as U3 on sheet MotorDriver; Manufacturer Part Number: DRV8701ERGET; Case/Package: VFQFN24; Supplier-1: ARROW; Supplier Part Number-1: DRV8701ERGET

## Sheet ADC.SchDoc
size A4; DocumentNumber: 8; SheetNumber: 8; SheetTotal: 12
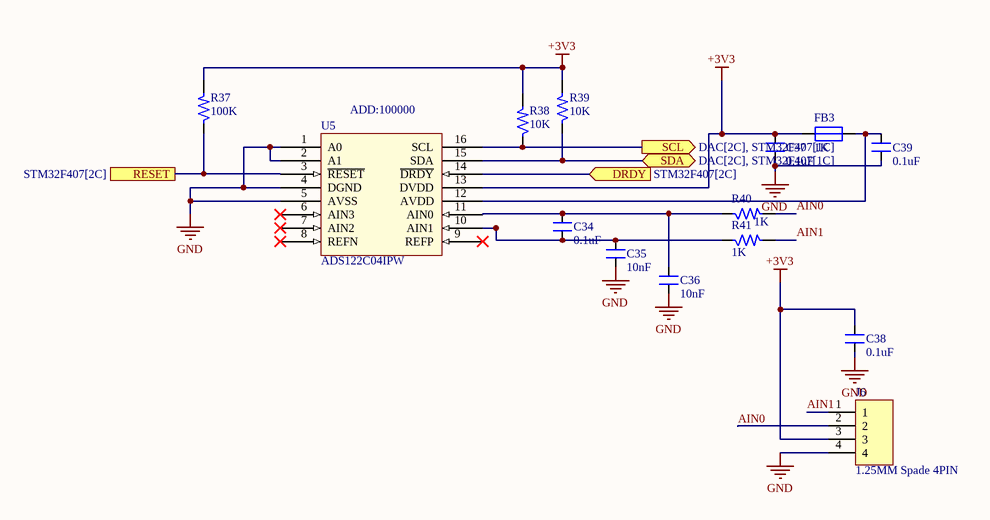
[diagram p7: ADC.SchDoc]

### Parts
C34  0.1uF  [CAP_0805]
C35  10nF  [CAP_0805]
C36  10nF  [CAP_0805]
C37  0.1uF  [CAP_0805]
C38  0.1uF  [CAP_0805]
C39  0.1uF  [CAP_0805]
FB3  1K  [IND_0805]
J6  1.25MM Spade 4PIN  [CON4_50_653004117322_TH_RA]
R37  100K  [RES_0603]
R38  10K  [RES_0603]
R39  10K  [RES_0603]
R40  1K  [RES_0603]
R41  1K  [RES_0603]
U5  ADS122C04IPW  [TSSOP16_25-59_294_54X14_SMT]

### Ports
DRDY (in, see STM32F407[2C]), RESET (see STM32F407[2C]), SCL (out, see DAC[2C], STM32F407[1C]), SDA (bidir, see DAC[2C], STM32F407[1C])

### Nets
+3V3: C37.2 C38.2 FB3.1 J6.3 R37.2 R38.2 R39.2 U5.13(DVDD)
GND: C35.1 C36.1 C37.1 C38.1 C39.1 J6.4 U5.1(A0) U5.2(A1) U5.4(DGND) U5.5(AVSS)
AIN0: J6.2 R40.2
AIN1: J6.1 R41.2
NetC34_1: C34.1 C35.2 R41.1 U5.10(AIN1)
NetC34_2: C34.2 C36.2 R40.1 U5.11(AIN0)
NetC39_2: C39.2 FB3.2 U5.12(AVDD)
NetR37_1: R37.1 U5.3(~{RESET}) ; port RESET
NetR38_1: R38.1 U5.16(SCL) ; port SCL
NetR39_1: R39.1 U5.15(SDA) ; port SDA
NetU5_14: U5.14(~{DRDY}) ; port DRDY

Not connected (* = marked no-connect by the designer): U5 6(AIN3)* 7(AIN2)* 8(REFN)* 9(REFP)*

### Notes on the sheet
- (near U5) ADD:100000

### Library data of the parts
C34 C37-C39 = CAP_0.1uF-50V-10%-0805: as C5 on sheet STM32Debuuger; Case/Package: 0805; Supplier-1: SIRICOM; Supplier Part Number-1: 0805B104K500CT
C35 C36 = CAP_10nF-50V-10%-0805: as C3 on sheet STM32Debuuger; Case/Package: 0805; Supplier-1: SIRICOM; Supplier Part Number-1: 0805B103K500CT
FB3 = FB_1K-100MHZ-1.6A-0805: as FB1 on sheet EthernetPHY; Case/Package: 0805; Supplier-1: SIRICOM; Supplier Part Number-1: ACMS201209A102
J6 = CON-PLG_4X1-50-RA-TH: 4 Pins, 1 Row 1.25mm Pitch, right angle Connector, male; Manufacturer Part Number: 653004117322; Manufacturer: JST; Mating Part Number: 653004113322; Crimp Part Number: 653153128130; Alternate Part Number-1: NA; Case/Package: TH-CON; Supplier-1: WURTH; Supplier Part Number-1: 653004117322
R37 = RES_100K-0.1W-1%-0603: 100 kOhms ±1% 0.1W, 1/10W Chip Resistor 0603 (1608 Metric) Automotive AEC-Q200 Thick Film; Manufacturer: Stackpole Electronics; Manufacturer Part Number: RMCF0603FT100K; Alternate Part Number-1: NA; Case/Package: 0603; Supplier-1: Arrow; Supplier Part Number-1: RMCF0603FT100K
R38 R39 = RES_10K-0.1W-1%-0603: as R1 on sheet STM32Debuuger; Case/Package: 0603; Supplier-1: SIRICOM; Supplier Part Number-1: WR06X1002FTL
R40 R41 = RES_1K-0.1W-1%-0603: 1 kOhms ±1% 0.1W, 1/10W Chip Resistor 0603 (1608 Metric) Automotive AEC-Q200 Thick Film; Manufacturer: Walsin; Manufacturer Part Number: WR06X1001FTL; Alternate Part Number-1: 0603WAF1001T5E; Case/Package: 0603; Supplier-1: SIRICOM; Supplier Part Number-1: WR06X1001FTL
U5 = IC_ADS122C04IPW: 24 Bit Analog to Digital Converter 4 Input 1 Sigma-Delta 16-TSSOP; Manufacturer: Texas Instruments; Alternate Part Number-1: NA; Manufacturer Part Number: ADS122C04IPW; Case/Package: TSSOP16; Supplier-1: MOUSER; Supplier Part Number-1: ADS122C04IPW

## Sheet DAC.SchDoc
size A4; DocumentNumber: 9; SheetNumber: 9; SheetTotal: 12
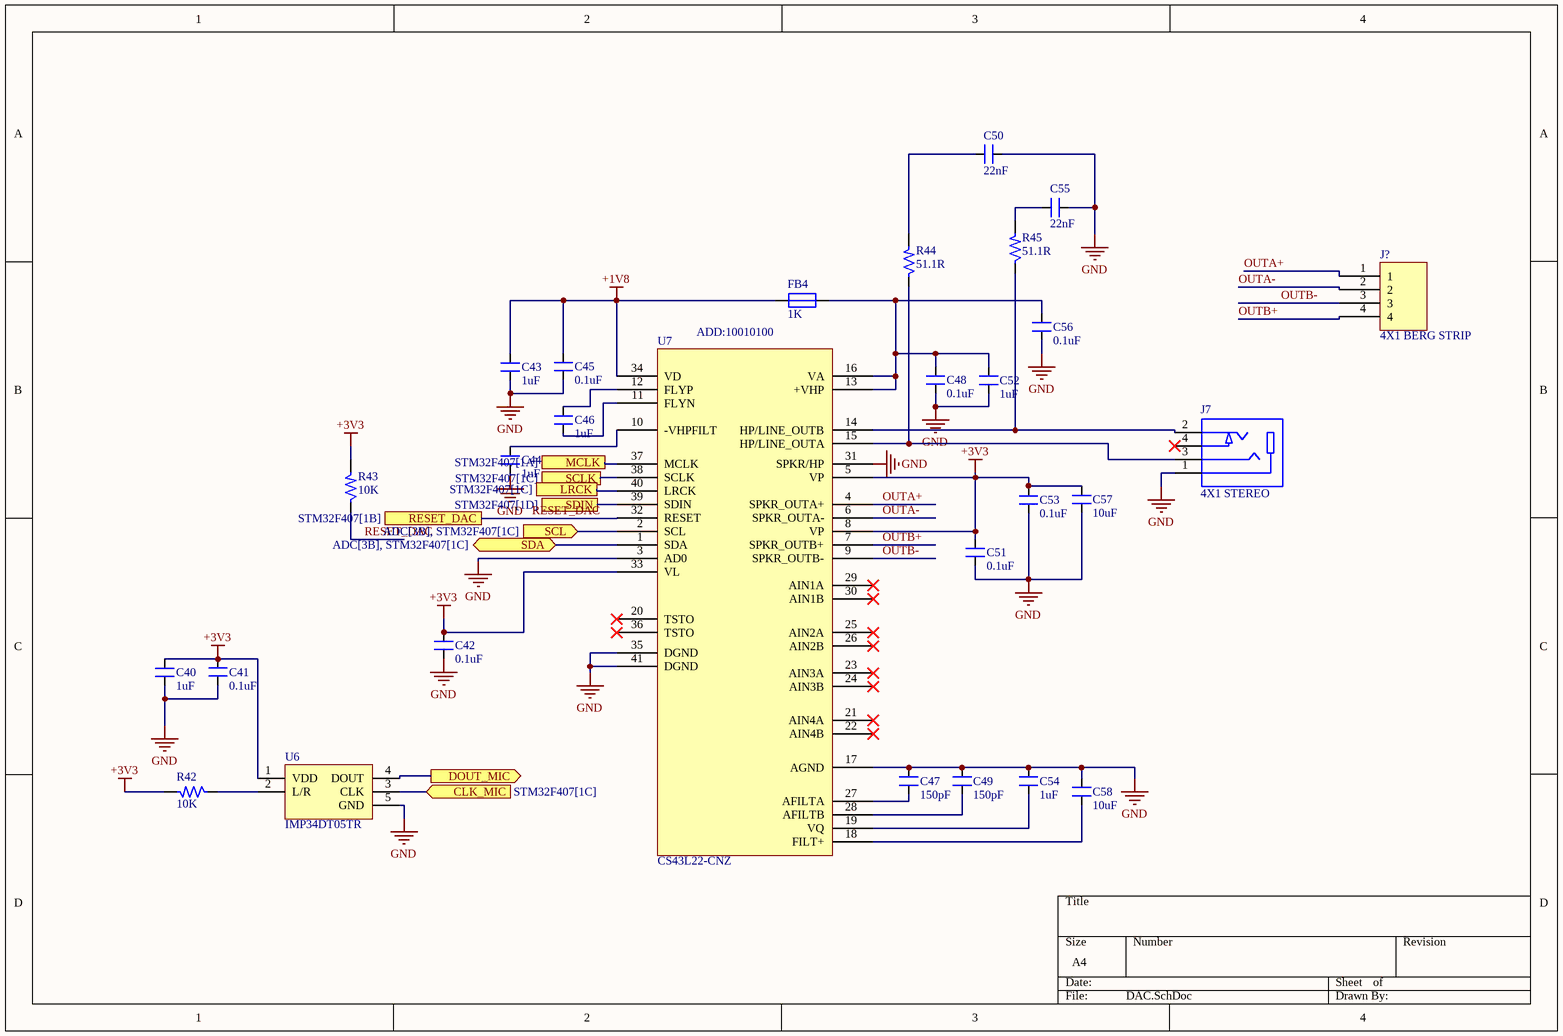
[diagram p8: DAC.SchDoc]

### Parts
C40  1uF  [CAP_0805]
C41  0.1uF  [CAP_0805]
C42  0.1uF  [CAP_0805]
C43  1uF  [CAP_0805]
C44  1uF  [CAP_0805]
C45  0.1uF  [CAP_0805]
C46  1uF  [CAP_0805]
C47  150pF  [CAP_0805]
C48  0.1uF  [CAP_0805]
C49  150pF  [CAP_0805]
C50  22nF  [CAP_0805]
C51  0.1uF  [CAP_0805]
C52  1uF  [CAP_0805]
C53  0.1uF  [CAP_0805]
C54  1uF  [CAP_0805]
C55  22nF  [CAP_0805]
C56  0.1uF  [CAP_0805]
C57  10uF  [CAP_1206]
C58  10uF  [CAP_1206]
FB4  1K  [IND_0805]
J7  4X1 STEREO  [CON_SJ-2504A-SMT-TR_SMD]
J?  4X1 BERG STRIP  [CON4_100_40D72_TH_ST_MALE]
R42  10K  [RES_0603]
R43  10K  [RES_0603]
R44  51.1R  [RES_0603]
R45  51.1R  [RES_0603]
U6  IMP34DT05TR  [HCLGA-4_53_137_15X37_SMD]
U7  CS43L22-CNZ  [QFN40_19_284_33X9_SMD]

### Ports
CLK_MIC (in, see STM32F407[1C]), DOUT_MIC (out), LRCK (see STM32F407[1C]), MCLK (see STM32F407[1A]), RESET_DAC (see STM32F407[1B]), SCL (in, see ADC[3B], STM32F407[1C]), SCLK (see STM32F407[1C]), SDA (bidir, see ADC[3B], STM32F407[1C]), SDIN (see STM32F407[1D])

### Nets
+1V8: C43.2 C45.2 FB4.1 U7.34(VD)
+3V3: C40.2 C41.2 C42.2 C51.2 C53.2 C57.2 R42.2 R43.2 U6.1(VDD) U7.5(VP) U7.8(VP) U7.33(VL)
GND: C40.1 C41.1 C42.1 C43.1 C44.1 C45.1 C47.2 C48.1 C49.2 C50.2 C51.1 C52.1 C53.1 C54.2 C55.2 C56.1 C57.1 C58.2 J7.1 U6.5(GND) U7.3(AD0) U7.17(AGND) U7.31(SPKR/HP) U7.35(DGND) U7.41(DGND)
OUTA+: J?.1 U7.4(SPKR_OUTA+)
OUTA-: J?.2 U7.6(SPKR_OUTA-)
OUTB+: J?.4 U7.7(SPKR_OUTB+)
OUTB-: J?.3 U7.9(SPKR_OUTB-)
RESET_DAC: R43.1 U7.32(RESET) ; port RESET_DAC
NetC44_2: C44.2 U7.10(-VHPFILT)
NetC46_1: C46.1 U7.11(FLYN)
NetC46_2: C46.2 U7.12(FLYP)
NetC47_1: C47.1 U7.27(AFILTA)
NetC48_2: C48.2 C52.2 C56.2 FB4.2 U7.13(+VHP) U7.16(VA)
NetC49_1: C49.1 U7.28(AFILTB)
NetC50_1: C50.1 R44.2
NetC54_1: C54.1 U7.19(VQ)
NetC55_1: C55.1 R45.2
NetC58_1: C58.1 U7.18(FILT+)
NetJ7_2: J7.2 R45.1 U7.14(HP/LINE_OUTB)
NetJ7_3: J7.3 R44.1 U7.15(HP/LINE_OUTA)
NetR38_1: U7.2(SCL) ; port SCL
NetR39_1: U7.1(SDA) ; port SDA
NetR42_1: R42.1 U6.2(L/R)
NetU6_3: U6.3(CLK) ; port CLK_MIC
NetU6_4: U6.4(DOUT) ; port DOUT_MIC
NetU7_37: U7.37(MCLK) ; port MCLK
NetU7_38: U7.38(SCLK) ; port SCLK
NetU7_39: U7.39(SDIN) ; port SDIN
NetU7_40: U7.40(LRCK) ; port LRCK

Not connected (* = marked no-connect by the designer): J7 4*; U7 20(TSTO)* 21(AIN4A)* 22(AIN4B)* 23(AIN3A)* 24(AIN3B)* 25(AIN2A)* 26(AIN2B)* 29(AIN1A)* 30(AIN1B)* 36(TSTO)*

### Notes on the sheet
- ADD:10010100

### Library data of the parts
C40 C43 C44 C46 C52 C54 = CAP_1uF-50V-5%-0805: as C4 on sheet STM32Debuuger; Case/Package: 0805; Supplier-1: SIRICOM; Supplier Part Number-1: CL21B105KBFNNNE
C41 C42 C45 C48 C51 C53 C56 = CAP_0.1uF-50V-20%-0805: 0.1µF ±20% 50V Ceramic Capacitor X7R 0805 (2012 Metric); Manufacturer: Samsung Electro-Mechanics; Manufacturer Part Number: CL21B104MBCNNNC; Alternate Part Number-1: NA; Case/Package: 0805; Supplier-1: SIRICOM; Supplier Part Number-1: 0805B104K500CT
C47 C49 = CAP_150pF-50V-10%-0805: 150pF ±10% 50V Ceramic Capacitor C0G, NP0 0805 (2012 Metric); Manufacturer: AVX Corporation; Manufacturer Part Number: 08055A151KAT2A; Alternate Part Number-1: NA; Case/Package: 0805; Supplier-1: Digikey; Supplier Part Number-1: 478-10501-1-ND - Cut Tape (CT)
C50 C55 = CAP_22nF-50V-10%-0805: 0.022µF ±10% 50V Ceramic Capacitor X7R 0805 (2012 Metric); Manufacturer: Samsung Electro-Mechanics; Manufacturer Part Number: CL21B223KBANNNC; Alternate Part Number-1: NA; Case/Package: 0805; Supplier-1: Digikey; Supplier Part Number-1: 1276-1081-1-ND - Cut Tape (CT)
C57 C58 = CAP_10uF-50V-10%-1206: as C11 on sheet EthernetPHY; Case/Package: 1206; Supplier-1: SIRICOM; Supplier Part Number-1: CC1206KKX5R9BB106
FB4 = FB_1K-100MHZ-1.6A-0805: as FB1 on sheet EthernetPHY; Case/Package: 0805; Supplier-1: SIRICOM; Supplier Part Number-1: ACMS201209A102
J7 = CON-PLG-STEREO_4X1-100-RA-SMD: 2.50mm (0.094", 3/32", Sub Mini, Miniature) - Headphone Phone Jack Stereo (4 Conductor, TRRS) Connector Solder; Manufacturer: CUI Devices; Manufacturer Part Number: SJ-2504A-SMT-TR; Alternate Part Number-1: NA; Case/Package: SMD; Supplier Part Number-1: CP-SJ-2504A-SMT-CT-ND - Cut Tape (CT); Supplier-1: Digikey
J? = CON-BS-PLG_4X1-100-ST-TH: 4 Pins, 1 Row 2.54mm Pitch, Straight bergstrip, Male; Manufacturer: NA; Manufacturer Part Number: NA; Case/Package: TH-CON; Supplier-1: SP ROAD; Supplier Part Number-1: NA; Alternate Part Number-1: NA
R42 R43 = RES_10K-0.1W-1%-0603: as R1 on sheet STM32Debuuger; Case/Package: 0603; Supplier-1: SIRICOM; Supplier Part Number-1: WR06X1002FTL
R44 R45 = RES_51.1R-0.1W-1%-0603: 51.1 Ohms ±1% 0.1W, 1/10W Chip Resistor 0603 (1608 Metric) Thick Film; Manufacturer: Vishay Dale; Manufacturer Part Number: CRCW060351R1FKEAC; Alternate Part Number-1: NA; Case/Package: 0603; Supplier-1: Digikey; Supplier Part Number-1: 541-5468-1-ND - Cut Tape (CT)
U6 = IC_IMP34DT05TR: MEMS Microphones AUTO & INDUSTRIAL SENSORS; Manufacturer: STMicroelectronics; Alternate Part Number-1: NA; Manufacturer Part Number: IMP34DT05TR; Case/Package: HCLGA-4; Supplier-1: Mouser; Supplier Part Number-1: 511-IMP34DT05TR
U7 = IC_CS43L22: Audio D/A Converter ICs Low Power Stereo DAC w/ClassD Spkr Driver; Manufacturer: Cirrus Logic; Alternate Part Number-1: NA; Manufacturer Part Number: CS43L22-CNZ; Case/Package: QFN-40; Supplier-1: Mouser; Supplier Part Number-1: 777-CS43L22-CNZ

## Sheet STM32F407.SchDoc
size A4; DocumentNumber: 10; SheetNumber: 10; SheetTotal: 12
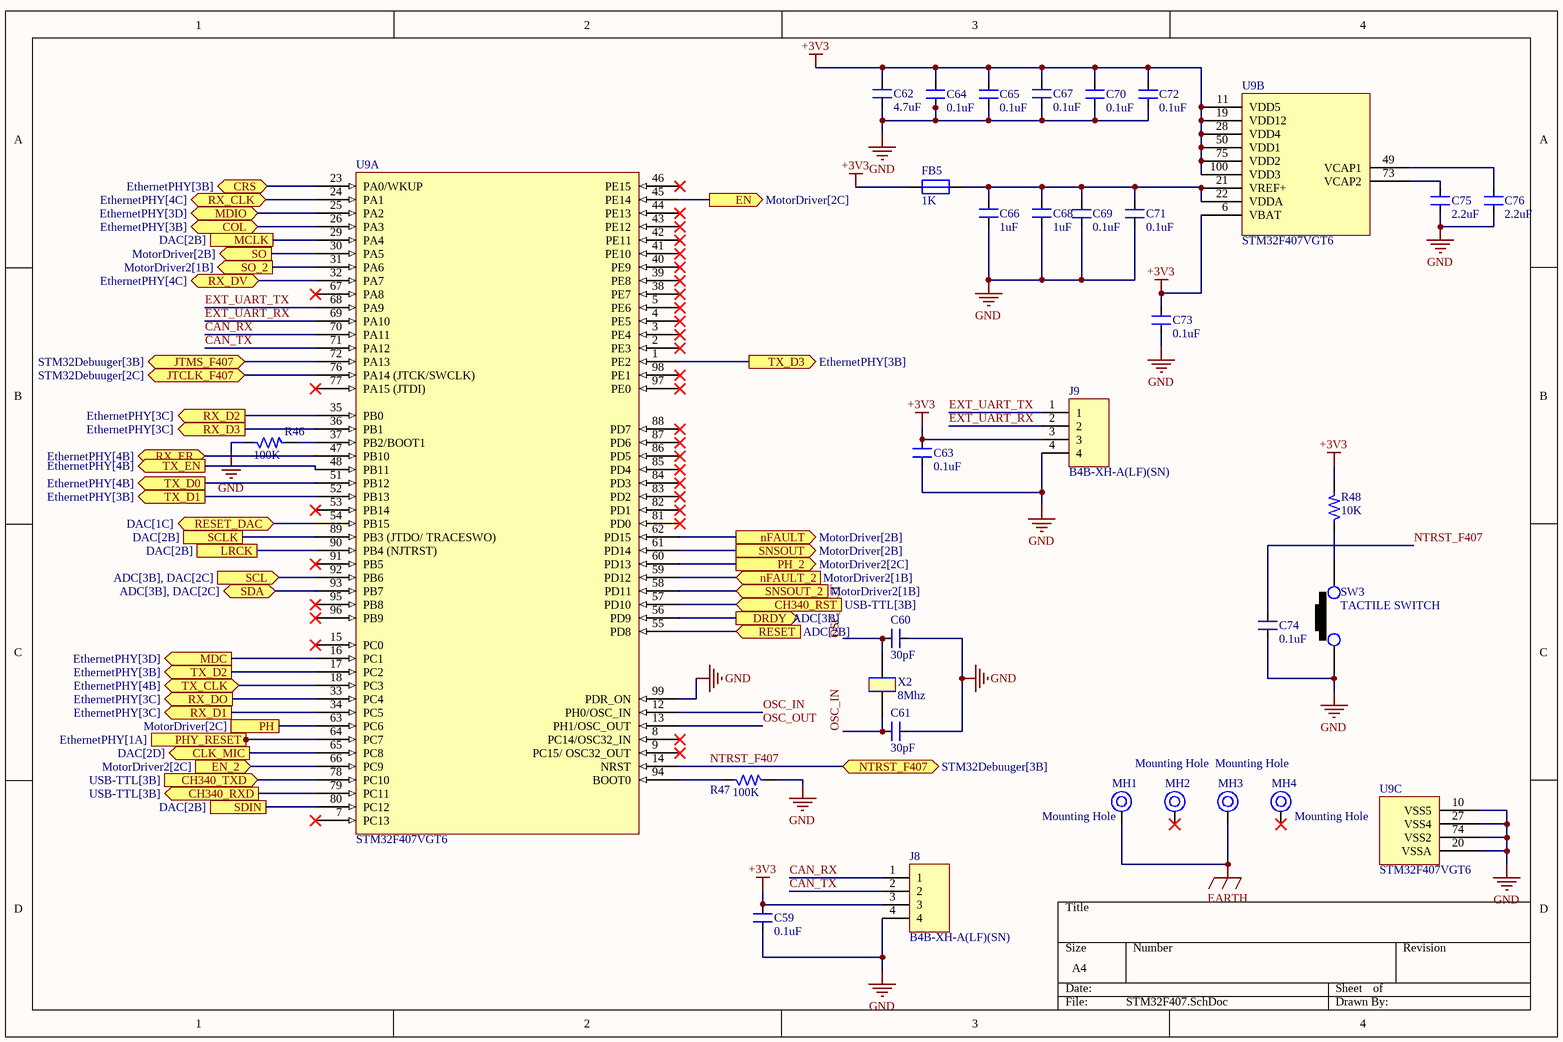
[diagram p9: STM32F407.SchDoc]

### Parts
C59  0.1uF  [CAP_0805]
C60  30pF  [CAP_0805]
C61  30pF  [CAP_0805]
C62  4.7uF  [CAP_0805]
C63  0.1uF  [CAP_0805]
C64  0.1uF  [CAP_0805]
C65  0.1uF  [CAP_0805]
C66  1uF  [CAP_0805]
C67  0.1uF  [CAP_0805]
C68  1uF  [CAP_0805]
C69  0.1uF  [CAP_0805]
C70  0.1uF  [CAP_0805]
C71  0.1uF  [CAP_0805]
C72  0.1uF  [CAP_0805]
C73  0.1uF  [CAP_0805]
C74  0.1uF  [CAP_0805]
C75  2.2uF  [CAP_0805]
C76  2.2uF  [CAP_0805]
FB5  1K  [IND_0805]
J8  B4B-XH-A(LF)(SN)  [CON4_100_B4B-XH-A_TH_ST]
J9  B4B-XH-A(LF)(SN)  [CON4_100_B4B-XH-A_TH_ST]
MH1  Mounting Hole  [MOUNTING]
MH2  Mounting Hole  [MOUNTING]
MH3  Mounting Hole  [MOUNTING]
MH4  Mounting Hole  [MOUNTING]
R46  100K  [RES_0603]
R47  100K  [RES_0603]
R48  10K  [RES_0603]
SW3  TACTILE SWITCH  [SW_342_SMD]
U9  STM32F407VGT6  [QFN100_19.6_669_58X10_SMD]  (parts A,B,C of 3)
X2  8Mhz  [XTAL_314_240X47_SMD]

### Ports
CH340_RST (in, see USB-TTL[3B]), CH340_RXD (out, see USB-TTL[3B]), CH340_TXD (in, see USB-TTL[3B]), CLK_MIC (out, see DAC[2D]), COL (bidir, see EthernetPHY[3B]), CRS (bidir, see EthernetPHY[3B]), DRDY (out, see ADC[3B]), EN (out, see MotorDriver[2C]), EN_2 (in, see MotorDriver2[2C]), JTCLK_F407 (bidir, see STM32Debuuger[2C]), JTMS_F407 (bidir, see STM32Debuuger[3B]), LRCK (see DAC[2B]), MCLK (see DAC[2B]), MDC (out, see EthernetPHY[3D]), MDIO (bidir, see EthernetPHY[3D]), nFAULT (out, see MotorDriver[2B]), nFAULT_2 (in, see MotorDriver2[1B]), NTRST_F407 (bidir, see STM32Debuuger[3B]), PH (see MotorDriver[2C]), PH_2 (out, see MotorDriver2[2C]), PHY_RESET (in, see EthernetPHY[1A]), RESET (in, see ADC[2B]), RESET_DAC (bidir, see DAC[1C]), RX_CLK (bidir, see EthernetPHY[4C]), RX_D1 (out, see EthernetPHY[3C]), RX_D2 (out, see EthernetPHY[3C]), RX_D3 (out, see EthernetPHY[3C]), RX_DO (out, see EthernetPHY[3C]), RX_DV (bidir, see EthernetPHY[4C]), RX_ER (bidir, see EthernetPHY[4B]), SCL (in, see ADC[3B], DAC[2C]), SCLK (see DAC[2B]), SDA (bidir, see ADC[3B], DAC[2C]), SDIN (see DAC[2B]), SNSOUT (out, see MotorDriver[2B]), SNSOUT_2 (in, see MotorDriver2[1B]), SO (out, see MotorDriver[2B]), SO_2 (out, see MotorDriver2[1B]), TX_CLK (bidir, see EthernetPHY[4B]), TX_D0 (out, see EthernetPHY[4B]), TX_D1 (out, see EthernetPHY[3B]), TX_D2 (out, see EthernetPHY[3B]), TX_D3 (out, see EthernetPHY[3B]), TX_EN (out, see EthernetPHY[4B])

### Nets
+3V3: C59.2 C62.2 C63.2 C64.2 C65.2 C67.2 C70.2 C72.2 C73.2 FB5.1 J8.3 J9.3 R48.2 U9.6(VBAT) U9.11(VDD5) U9.19(VDD12) U9.28(VDD4) U9.50(VDD1) U9.75(VDD2) U9.100(VDD3)
EARTH: MH1.1 MH3.1
GND: C59.1 C60.2 C61.2 C62.1 C63.1 C64.1 C65.1 C66.1 C67.1 C68.1 C69.1 C70.1 C71.1 C72.1 C73.1 C74.1 C75.1 C76.1 J8.4 J9.4 R46.1 R47.2 SW3.1 U9.10(VSS5) U9.20(VSSA) U9.27(VSS4) U9.74(VSS2) U9.99(PDR_ON)
CAN_RX: J8.1 U9.70(PA11)
CAN_TX: J8.2 U9.71(PA12)
COL: U9.26(PA3) ; port COL
CRS: U9.23(PA0/WKUP) ; port CRS
EXT_UART_RX: J9.2 U9.69(PA10)
EXT_UART_TX: J9.1 U9.68(PA9)
nFAULT: U9.62(PD15) ; port nFAULT
nFAULT_2: U9.59(PD12) ; port nFAULT_2
NTRST_F407: C74.2 U9.14(NRST) ; port NTRST_F407
OSC_IN: C61.1 U9.12(PH0/OSC_IN) X2.1
OSC_OUT: C60.1 U9.13(PH1/OSC_OUT) X2.2
PHY_RESET: U9.64(PC7) ; port PHY_RESET
RESET_DAC: U9.54(PB15) ; port RESET_DAC
SNSOUT: U9.61(PD14) ; port SNSOUT
SNSOUT_2: U9.58(PD11) ; port SNSOUT_2
SO: U9.30(PA5) ; port SO
SO_2: U9.31(PA6) ; port SO_2
NetC66_2: C66.2 C68.2 C69.2 C71.2 FB5.2 U9.21(VREF+) U9.22(VDDA)
NetC75_2: C75.2 U9.73(VCAP2)
NetC76_2: C76.2 U9.49(VCAP1)
NetR9_1: U9.25(PA2) ; port MDIO
NetR19_1: U9.45(PE14) ; port EN
NetR31_1: U9.66(PC9) ; port EN_2
NetR37_1: U9.55(PD8) ; port RESET
NetR38_1: U9.92(PB6) ; port SCL
NetR39_1: U9.93(PB7) ; port SDA
NetR46_2: R46.2 U9.37(PB2/BOOT1)
NetR47_1: R47.1 U9.94(BOOT0)
NetR48_1: R48.1 SW3.2
NetU1_18: U9.76(PA14_(JTCK/SWCLK)) ; port JTCLK_F407
NetU1_25: U9.72(PA13) ; port JTMS_F407
NetU2_12: U9.16(PC1) ; port MDC
NetU2_13: U9.36(PB1) ; port RX_D3
NetU2_14: U9.35(PB0) ; port RX_D2
NetU2_15: U9.34(PC5) ; port RX_D1
NetU2_16: U9.33(PC4) ; port RX_DO
NetU2_18: U9.32(PA7) ; port RX_DV
NetU2_19: U9.24(PA1) ; port RX_CLK
NetU2_20: U9.47(PB10) ; port RX_ER
NetU2_22: U9.18(PC3) ; port TX_CLK
NetU2_23: U9.48(PB11) ; port TX_EN
NetU2_24: U9.51(PB12) ; port TX_D0
NetU2_25: U9.52(PB13) ; port TX_D1
NetU2_26: U9.17(PC2) ; port TX_D2
NetU2_27: U9.1(PE2) ; port TX_D3
NetU3_15: U9.63(PC6) ; port PH
NetU4_15: U9.60(PD13) ; port PH_2
NetU5_14: U9.56(PD9) ; port DRDY
NetU6_3: U9.65(PC8) ; port CLK_MIC
NetU7_37: U9.29(PA4) ; port MCLK
NetU7_38: U9.89(PB3_(JTDO/_TRACESWO)) ; port SCLK
NetU7_39: U9.80(PC12) ; port SDIN
NetU7_40: U9.90(PB4_(NJTRST)) ; port LRCK
NetU9_57: U9.57(PD10) ; port CH340_RST
NetU9_78: U9.78(PC10) ; port CH340_TXD
NetU9_79: U9.79(PC11) ; port CH340_RXD

Not connected (* = marked no-connect by the designer): MH2 1*; MH4 1*; U9 2(PE3)* 3(PE4)* 4(PE5)* 5(PE6)* 7(PC13)* 8(PC14/OSC32_IN)* 9(PC15/_OSC32_OUT)* 15(PC0)* 38(PE7)* 39(PE8)* 40(PE9)* 41(PE10)* 42(PE11)* 43(PE12)* 44(PE13)* 46(PE15)* 53(PB14)* 67(PA8)* 77(PA15_(JTDI))* 81(PD0)* 82(PD1)* 83(PD2)* 84(PD3)* 85(PD4)* 86(PD5)* 87(PD6)* 88(PD7)* 91(PB5)* 95(PB8)* 96(PB9)* 97(PE0)* 98(PE1)*

### Library data of the parts
C59 C63-C65 C67 C69-C74 = CAP_0.1uF-50V-10%-0805: as C5 on sheet STM32Debuuger; Case/Package: 0805; Supplier-1: SIRICOM; Supplier Part Number-1: 0805B104K500CT
C60 C61 = CAP_30pF-50V-10%-0805: as C1 on sheet STM32Debuuger; Case/Package: 0805; Supplier-1: Digikey; Supplier Part Number-1: 399-17443-1-ND - Cut Tape (CT)
C62 = CAP_4.7uF-50V-10%-0805: as C7 on sheet STM32Debuuger; Case/Package: 0805; Supplier-1: SIRICOM; Supplier Part Number-1: CL21A475KBQNNNE
C66 C68 = CAP_1uF-50V-5%-0805: as C4 on sheet STM32Debuuger; Case/Package: 0805; Supplier-1: SIRICOM; Supplier Part Number-1: CL21B105KBFNNNE
C75 C76 = CAP_2.2uF-25V-10%-0805: 2.2µF ±10% 25V Ceramic Capacitor X7R 0805 (2012 Metric); Manufacturer: KEMET; Manufacturer Part Number: CL21B225KAFNFNE; Alternate Part Number-1: NA; Case/Package: 0805; Supplier-1: SIRICOM; Supplier Part Number-1: CL21A225KAFNNNE
FB5 = FB_1K-100MHZ-1.6A-0805: as FB1 on sheet EthernetPHY; Case/Package: 0805; Supplier-1: SIRICOM; Supplier Part Number-1: ACMS201209A102
J8 J9 = CON-PLG_4X1-100-ST-TH: 4 Pins, 1 Row 2.54mm Pitch, straight Connector, male; Manufacturer: Wurth Electronics; Mating Part Number: XHP-4; Crimp Part Number: ASXHSXH22K51; Alternate Part Number-1: NA; Manufacturer Part Number: B4B-XH-A(LF)(SN); Case/Package: TH-CON; Supplier-1: LCSC; Supplier Part Number-1: B4B-XH-A(LF)(SN)
MH1-MH4 = MH_3.5H_6D: Manufacturer Part Number: NA; Case/Package: TH; Manufacturer: NA; Supplier-1: NA; Supplier Part Number-1: NA; Alternate Part Number-1: NA
R46 R47 = RES_100K-0.1W-1%-0603: as R37 on sheet ADC; Case/Package: 0603; Supplier-1: Arrow; Supplier Part Number-1: RMCF0603FT100K
R48 = RES_10K-0.1W-1%-0603: as R1 on sheet STM32Debuuger; Case/Package: 0603; Supplier-1: SIRICOM; Supplier Part Number-1: WR06X1002FTL
SW3 = SW1_RS-282G05A3-SMRT-SMD: as SW1 on sheet STM32Debuuger; Manufacturer Part Number: RS-282G05A3-SMRT; Case/Package: SMD; Supplier-1: SP ROAD; Supplier Part Number-1: RS-282G05A3-SMRT
U9 = IC_STM32F407VGT6: ARM® Cortex®-M4 STM32F4 Microcontroller IC 32-Bit 168MHz 1MB (1M x 8) FLASH 100-LQFP (14x14); Manufacturer: STMicroelectronics; Alternate Part Number-1: STM32F407VET6; Manufacturer Part Number: STM32F407VGT6; Case/Package: LQFP100; Supplier-1: ARROW; Supplier Part Number-1: STM32F407VGT6
X2 = XTAL_8MHZ-ECS-80-32-5PX-SMD: as X1 on sheet STM32Debuuger; Case/Package: SMD/SMT; Supplier-1: SP ROAD; Supplier Part Number-1: ECS-80-32-5PX-TR

## Sheet Power.SchDoc
size A4; DocumentNumber: 11; SheetNumber: 11; SheetTotal: 12
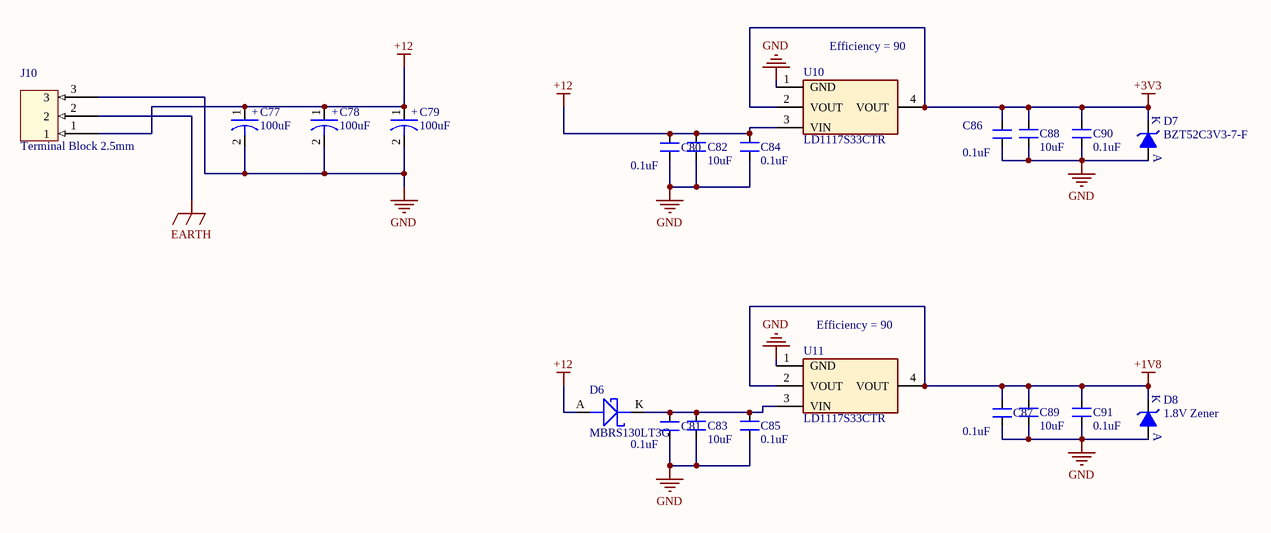
[diagram p10: Power.SchDoc]

### Parts
C77  100uF  [ACAP_P305_D393_H393_RAD]
C78  100uF  [ACAP_P305_D393_H393_RAD]
C79  100uF  [ACAP_P305_D393_H393_RAD]
C80  0.1uF  [CAP_0805]
C81  0.1uF  [CAP_0805]
C82  10uF  [CAP_1206]
C83  10uF  [CAP_1206]
C84  0.1uF  [CAP_0805]
C85  0.1uF  [CAP_0805]
C86  0.1uF  [CAP_0805]
C87  0.1uF  [CAP_0805]
C88  10uF  [CAP_1206]
C89  10uF  [CAP_1206]
C90  0.1uF  [CAP_0805]
C91  0.1uF  [CAP_0805]
D6  MBRS130LT3G  [DIO_SMB_DO-214AA]
D7  BZT52C3V3-7-F  [DIO_SOD-123]
D8  1.8V Zener  [DIO_DO-213AB_SMD]
J10  Terminal Block 2.5mm  [CON3_100_TB_TH_ST]
U10  LD1117S33CTR  [SOT223_3]
U11  LD1117S33CTR  [SOT223_3]

### Nets
+1V8: C87.2 C89.2 C91.2 D8.K U11.2(VOUT) U11.4(VOUT)
+3V3: C86.2 C88.2 C90.2 D7.K U10.2(VOUT) U10.4(VOUT)
+12: C77.1 C78.1 C79.1 C80.2 C82.2 C84.2 D6.A J10.1 U10.3(VIN)
EARTH: J10.2
GND: C77.2 C78.2 C79.2 C80.1 C81.1 C82.1 C83.1 C84.1 C85.1 C86.1 C87.1 C88.1 C89.1 C90.1 C91.1 D7.A D8.A J10.3 U10.1(GND) U11.1(GND)
NetC81_2: C81.2 C83.2 C85.2 D6.K U11.3(VIN)

### Notes on the sheet
- (near U10) Efficiency = 90
- (near U11) Efficiency = 90
- (in symbol CAP-P_100uF-50V-20%-RAD) +

### Library data of the parts
C77-C79 = CAP-P_100uF-50V-20%-RAD: 100µF 50V Aluminum Polymer Capacitor Radial, Can - SMD 28mOhm 4000 Hrs @ 125°C; Manufacturer: Nichicon; Manufacturer Part Number: GYA1H101MCQ1GS; Alternate Part Number-1: VEU101M1HTR-1010; Case/Package: Radial-SMD; Supplier-1: SP ROAD; Supplier Part Number-1: GYA1H101MCQ1GS
C80 C81 C86 C87 = CAP_0.1uF-50V-20%-0805: as C41 on sheet DAC; Case/Package: 0805; Supplier-1: SIRICOM; Supplier Part Number-1: 0805B104K500CT
C82 C83 C88 C89 = CAP_10uF-50V-10%-1206: as C11 on sheet EthernetPHY; Case/Package: 1206; Supplier-1: SIRICOM; Supplier Part Number-1: CC1206KKX5R9BB106
C84 C85 C90 C91 = CAP_0.1uF-50V-10%-0805: as C5 on sheet STM32Debuuger; Case/Package: 0805; Supplier-1: SIRICOM; Supplier Part Number-1: 0805B104K500CT
D6 = DIO-S_445mV-30V-2A-SMB: Diode Schottky 30V 2A Surface Mount SMB; Manufacturer: ON Semiconductor; Alternate Part Number-1: NA; Manufacturer Part Number: MBRS130LT3G; Case/Package: SMB; Supplier-1: ARROW; Supplier Part Number-1: MBRS130LT3G
D7 = DIO-Z_3.3V-500mW-SOD123: Zener Diode 3.3V 500mW ±6% Surface Mount SOD-123; Manufacturer: Diodes Incorporated; Alternate Part Number-1: NA; Manufacturer Part Number: BZT52C3V3-7-F; Case/Package: SOD-123; Supplier-1: Digikey; Supplier Part Number-1: BZT52C3V3-FDICT-ND
D8 = DIO-Z_1.8V-500mW-DO213AA: Zener Diode 1.8V 500mW ±5% Surface Mount DO-213AA; Manufacturer: *; Manufacturer Part Number: *; Case/Package: *; Supplier-1: *; Supplier Part Number-1: *; Alternate Part Number-1: *
J10 = CON-TB_3X1-100-ST-TH: 3 Pins, 1 Row 2.54mm Pitch, straight Connector, male; Manufacturer Part Number: 1725669; Manufacturer: Phoenix Contact; Alternate Part Number-1: NA; Case/Package: TH-CON; Supplier-1: SP ROAD; Supplier Part Number-1: 1725669
U10 U11 = REG_15V-3.3V-0.9A-12W-SOT223: Linear Voltage Regulator IC 1 Output 800mA SOT-223; Manufacturer: STMicroelectronics; Alternate Part Number-1: NA; Manufacturer Part Number: LD1117S33CTR; Case/Package: SOT223; Supplier-1: SP ROAD; Supplier Part Number-1: LD1117S33CTR

## Sheet USB-TTL.SchDoc
size A4; DocumentNumber: 12; SheetNumber: 12; SheetTotal: 12
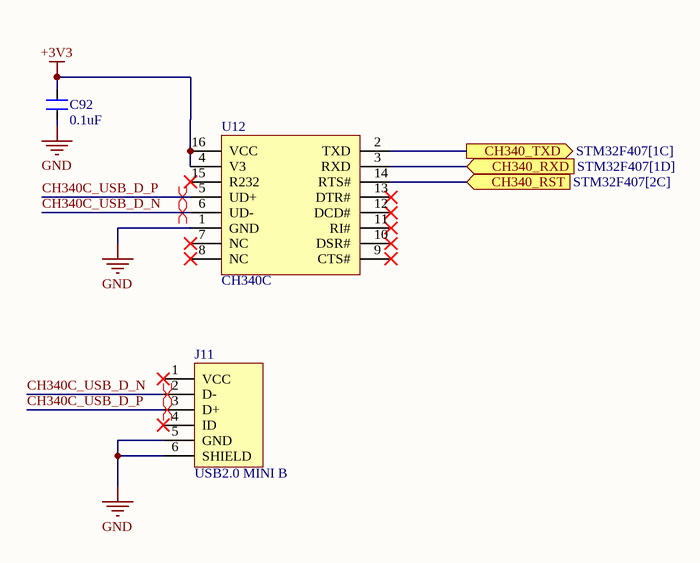
[diagram p11: USB-TTL.SchDoc]

### Parts
C92  0.1uF  [CAP_0805]
J11  USB2.0 MINI B  [CON_690-005-299-043]
U12  CH340C  [SOIC16_50_284_25X90_SMT]

### Ports
CH340_RST (in, see STM32F407[2C]), CH340_RXD (in, see STM32F407[1D]), CH340_TXD (out, see STM32F407[1C])

### Nets
+3V3: C92.2 U12.4(V3) U12.16(VCC)
GND: C92.1 J11.5(GND) J11.6(SHIELD) U12.1(GND)
CH340C_USB_D_N: J11.2(D-) U12.6(UD-)
CH340C_USB_D_P: J11.3(D+) U12.5(UD+)
NetU9_57: U12.14(RTS#) ; port CH340_RST
NetU9_78: U12.2(TXD) ; port CH340_TXD
NetU9_79: U12.3(RXD) ; port CH340_RXD

Not connected (* = marked no-connect by the designer): J11 1(VCC)* 4(ID)*; U12 7(NC)* 8(NC)* 9(CTS#)* 10(DSR#)* 11(RI#)* 12(DCD#)* 13(DTR#)* 15(R232)*

### Layout directives
differential pair: CH340C_USB_D_N, CH340C_USB_D_P

### Library data of the parts
C92 = CAP_0.1uF-50V-10%-0805: as C5 on sheet STM32Debuuger; Case/Package: 0805; Supplier-1: SIRICOM; Supplier Part Number-1: 0805B104K500CT
J11 = CON_USB2.0-MINIB-SMD: as J1 on sheet STM32Debuuger; Case/Package: USB-MINI-B; Supplier-1: LCSC; Supplier Part Number-1: C105424
U12 = IC_CH340C: USB Bridge, USB to UART USB 2.0 UART Interface; Manufacturer: Olimex; Alternate Part Number-1: NA; Manufacturer Part Number: CH340C; Case/Package: SOIC16; Supplier-1: LCSC; Supplier Part Number-1: C84681

## Nets that join several sheets
+1V8: DAC (C43.2 C45.2 FB4.1 U7.34), Power (6 pins)
+3V3: STM32Debuuger (14 pins), EthernetPHY (10 pins), MotorDriver (R18.2), MotorDriver2 (R30.2), ADC (8 pins), DAC (12 pins), STM32F407 (20 pins), Power (6 pins), USB-TTL (C92.2 U12.4 U12.16)
+12: MotorDriver (7 pins), MotorDriver2 (6 pins), Power (9 pins)
EARTH: EthernetPHY (C10.1 R5.1), STM32F407 (MH1.1 MH3.1), Power (J10.2)
GND: STM32Debuuger (19 pins), EthernetPHY (20 pins), MotorDriver (12 pins), MotorDriver2 (11 pins), ADC (10 pins), DAC (25 pins), STM32F407 (28 pins), Power (20 pins), USB-TTL (C92.1 J11.5 J11.6 U12.1)
COL: EthernetPHY (DS1.A U2.28), STM32F407 (U9.26)
CRS: EthernetPHY (DS2.A U2.29), STM32F407 (U9.23)
NetR9_1: EthernetPHY (R9.1 U2.11), STM32F407 (U9.25)
NetR19_1: MotorDriver (R19.1 U3.14), STM32F407 (U9.45)
NetR31_1: MotorDriver2 (R31.1 U4.14), STM32F407 (U9.66)
NetR37_1: ADC (R37.1 U5.3), STM32F407 (U9.55)
NetR38_1: ADC (R38.1 U5.16), DAC (U7.2), STM32F407 (U9.92)
NetR39_1: ADC (R39.1 U5.15), DAC (U7.1), STM32F407 (U9.93)
NetU1_18: STM32Debuuger (U1.18), STM32F407 (U9.76)
NetU1_25: STM32Debuuger (U1.25 U1.27), STM32F407 (U9.72)
NetU2_12: EthernetPHY (U2.12), STM32F407 (U9.16)
NetU2_13: EthernetPHY (U2.13), STM32F407 (U9.36)
NetU2_14: EthernetPHY (U2.14), STM32F407 (U9.35)
NetU2_15: EthernetPHY (U2.15), STM32F407 (U9.34)
NetU2_16: EthernetPHY (U2.16), STM32F407 (U9.33)
NetU2_18: EthernetPHY (U2.18), STM32F407 (U9.32)
NetU2_19: EthernetPHY (U2.19), STM32F407 (U9.24)
NetU2_20: EthernetPHY (U2.20), STM32F407 (U9.47)
NetU2_22: EthernetPHY (U2.22), STM32F407 (U9.18)
NetU2_23: EthernetPHY (U2.23), STM32F407 (U9.48)
NetU2_24: EthernetPHY (U2.24), STM32F407 (U9.51)
NetU2_25: EthernetPHY (U2.25), STM32F407 (U9.52)
NetU2_26: EthernetPHY (U2.26), STM32F407 (U9.17)
NetU2_27: EthernetPHY (U2.27), STM32F407 (U9.1)
NetU3_15: MotorDriver (U3.15), STM32F407 (U9.63)
NetU4_15: MotorDriver2 (U4.15), STM32F407 (U9.60)
NetU5_14: ADC (U5.14), STM32F407 (U9.56)
NetU6_3: DAC (U6.3), STM32F407 (U9.65)
NetU7_37: DAC (U7.37), STM32F407 (U9.29)
NetU7_38: DAC (U7.38), STM32F407 (U9.89)
NetU7_39: DAC (U7.39), STM32F407 (U9.80)
NetU7_40: DAC (U7.40), STM32F407 (U9.90)
NetU9_57: STM32F407 (U9.57), USB-TTL (U12.14)
NetU9_78: STM32F407 (U9.78), USB-TTL (U12.2)
NetU9_79: STM32F407 (U9.79), USB-TTL (U12.3)
nFAULT: MotorDriver (R14.1 U3.9), STM32F407 (U9.62)
nFAULT_2: MotorDriver2 (R26.1 U4.9), STM32F407 (U9.59)
NTRST_F407: STM32Debuuger (U1.26), STM32F407 (C74.2 U9.14)
PHY_RESET: EthernetPHY (R8.1 SW2.2 U2.32), STM32F407 (U9.64)
RESET_DAC: DAC (R43.1 U7.32), STM32F407 (U9.54)
SNSOUT: MotorDriver (R13.1 U3.10), STM32F407 (U9.61)
SNSOUT_2: MotorDriver2 (R25.1 U4.10), STM32F407 (U9.58)
SO: MotorDriver (U3.11), STM32F407 (U9.30)
SO_2: MotorDriver2 (U4.11), STM32F407 (U9.31)